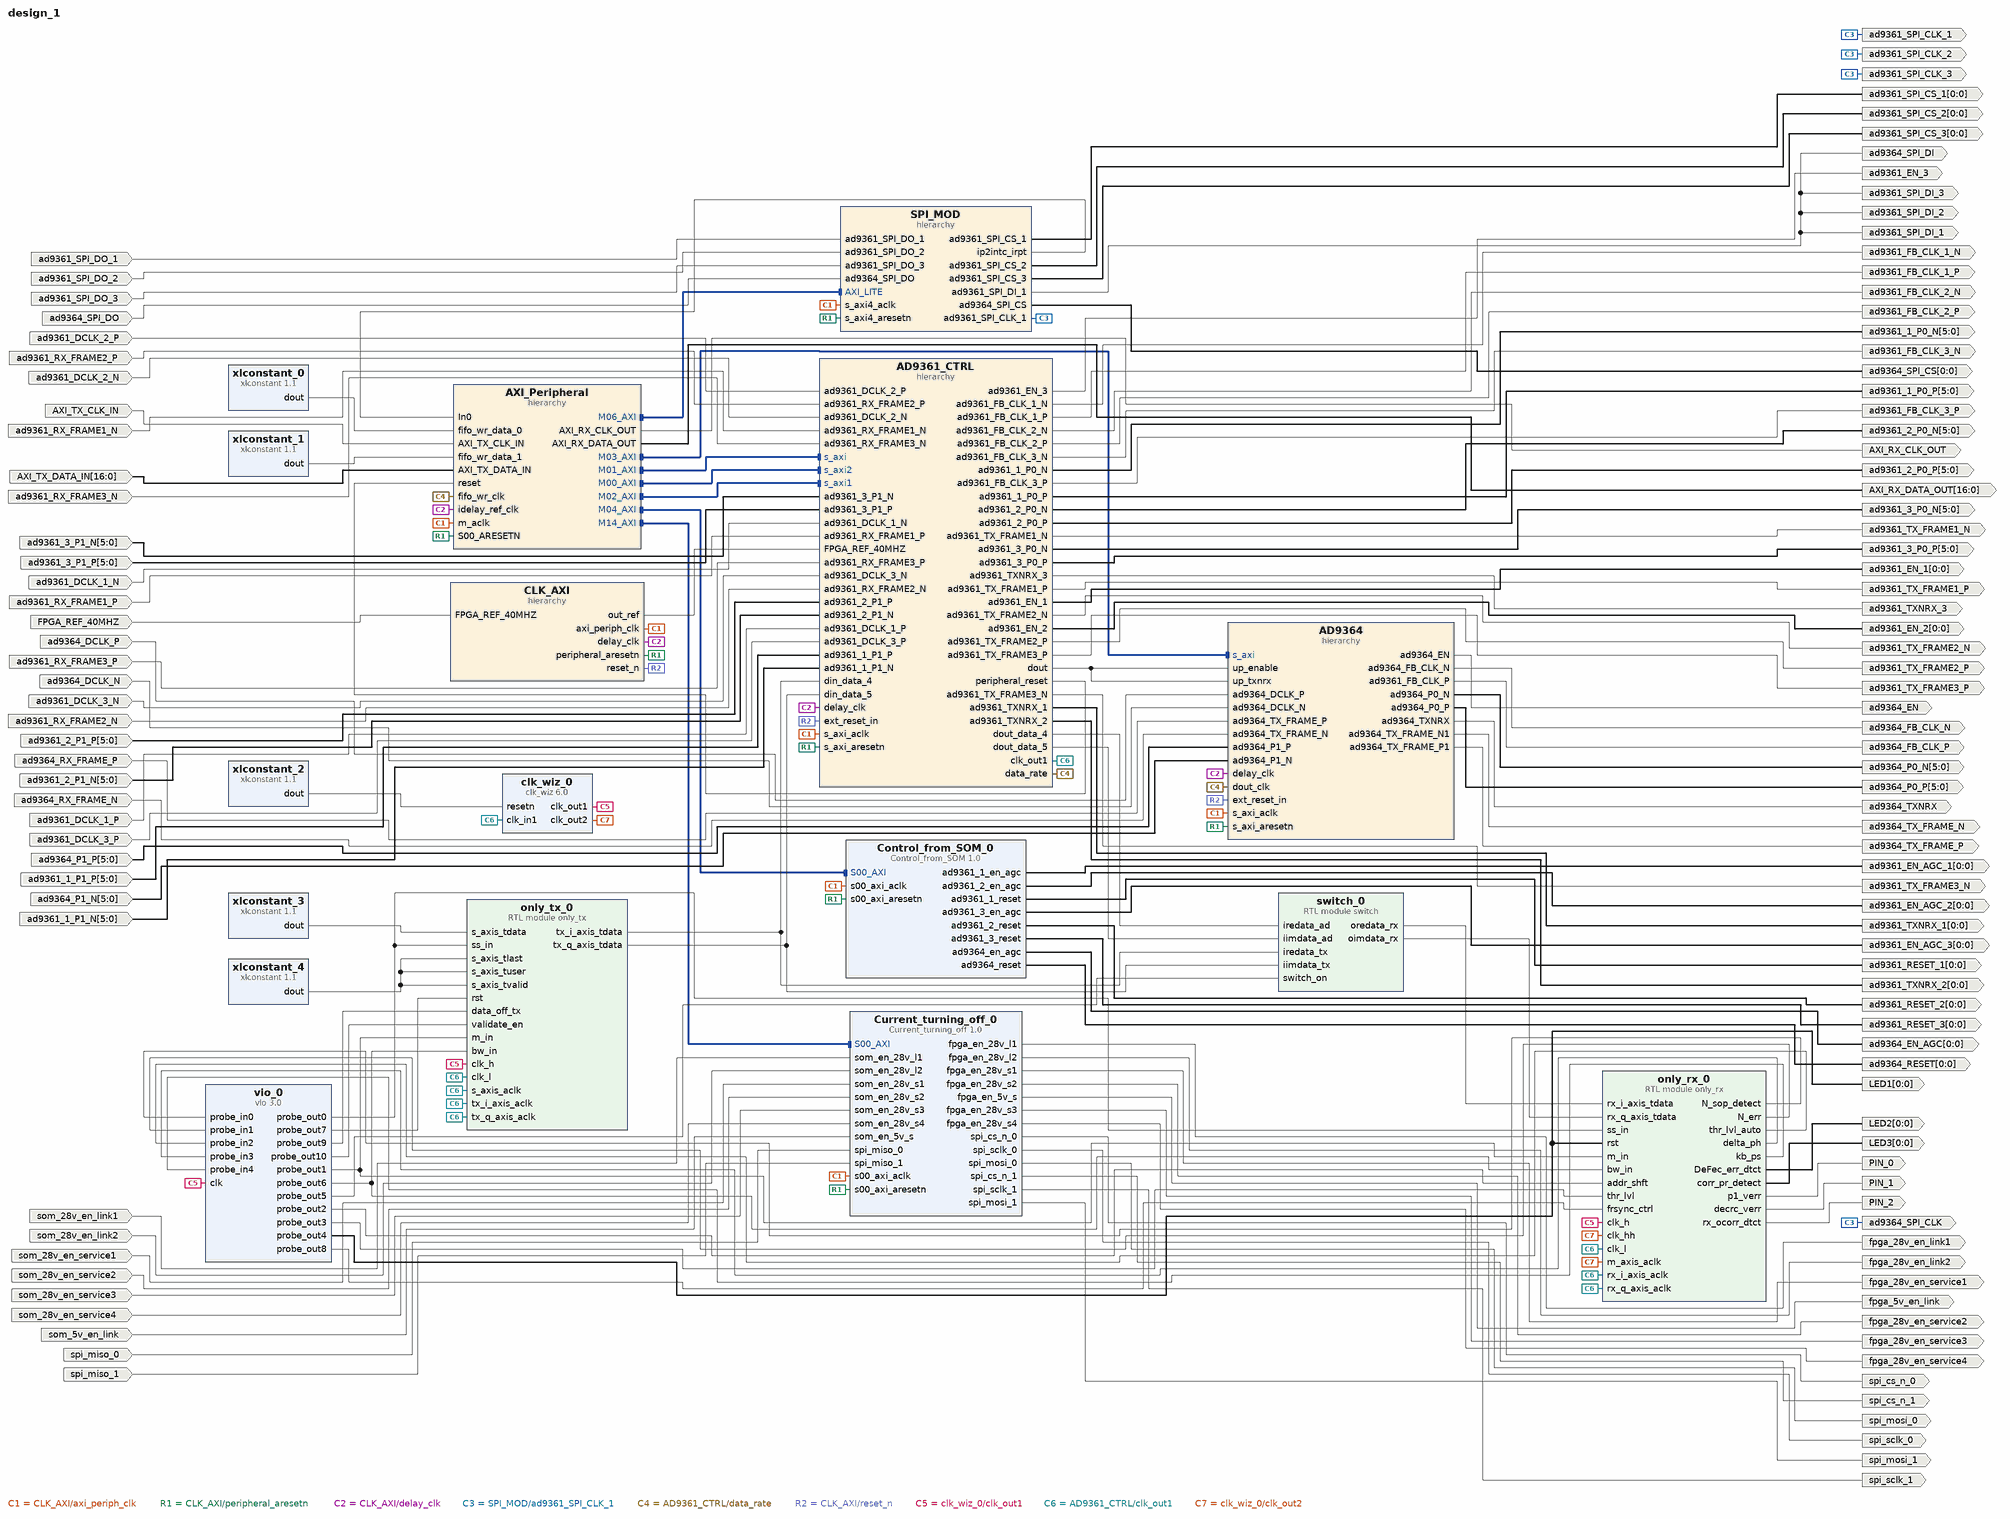
[diagram p0: block diagram of the top level]
# Vivado block design design_1, xc7k325tffg676-2, Vivado 2019.1
create_bd_design design_1

create_bd_port -dir O AXI_RX_CLK_OUT
create_bd_port -dir O -from 16 -to 0 AXI_RX_DATA_OUT
create_bd_port -dir I AXI_TX_CLK_IN
create_bd_port -dir I -from 16 -to 0 AXI_TX_DATA_IN
create_bd_port -dir I FPGA_REF_40MHZ
create_bd_port -dir O -from 0 -to 0 ad9361_EN_1
create_bd_port -dir O -from 0 -to 0 ad9361_EN_2
create_bd_port -dir O ad9361_EN_3
create_bd_port -dir O -from 0 -to 0 ad9361_TXNRX_1
create_bd_port -dir O -from 0 -to 0 ad9361_TXNRX_2
create_bd_port -dir O ad9361_TXNRX_3
create_bd_port -dir O ad9364_EN
create_bd_port -dir O ad9364_TXNRX
create_bd_port -dir O -from 0 -to 0 ad9361_RESET_1
create_bd_port -dir O -from 0 -to 0 ad9361_RESET_2
create_bd_port -dir O -from 0 -to 0 ad9361_RESET_3
create_bd_port -dir O -from 0 -to 0 ad9364_RESET
create_bd_port -dir O -from 0 -to 0 ad9361_SPI_CS_3
create_bd_port -dir O ad9361_SPI_CLK_3
create_bd_port -dir O ad9361_SPI_DI_3
create_bd_port -dir O ad9361_SPI_CLK_1
create_bd_port -dir O -from 0 -to 0 ad9361_SPI_CS_1
create_bd_port -dir O ad9361_SPI_DI_1
create_bd_port -dir O ad9361_SPI_CLK_2
create_bd_port -dir O -from 0 -to 0 ad9361_SPI_CS_2
create_bd_port -dir O ad9361_SPI_DI_2
create_bd_port -dir O ad9364_SPI_CLK
create_bd_port -dir O -from 0 -to 0 ad9364_SPI_CS
create_bd_port -dir O ad9364_SPI_DI
create_bd_port -dir I ad9361_DCLK_1_P
create_bd_port -dir I ad9361_DCLK_1_N
create_bd_port -dir I ad9361_DCLK_2_N
create_bd_port -dir I ad9361_DCLK_2_P
create_bd_port -dir I ad9361_DCLK_3_N
create_bd_port -dir I ad9364_DCLK_P
create_bd_port -dir I ad9364_DCLK_N
create_bd_port -dir I ad9361_RX_FRAME1_P
create_bd_port -dir I ad9361_RX_FRAME1_N
create_bd_port -dir I ad9361_RX_FRAME2_P
create_bd_port -dir I ad9361_RX_FRAME2_N
create_bd_port -dir I ad9361_RX_FRAME3_P
create_bd_port -dir I ad9364_RX_FRAME_P
create_bd_port -dir I ad9361_RX_FRAME3_N
create_bd_port -dir I ad9364_RX_FRAME_N
create_bd_port -dir I -from 5 -to 0 ad9361_1_P1_P
create_bd_port -dir I -from 5 -to 0 ad9361_1_P1_N
create_bd_port -dir I -from 5 -to 0 ad9361_2_P1_N
create_bd_port -dir I -from 5 -to 0 ad9361_2_P1_P
create_bd_port -dir I -from 5 -to 0 ad9361_3_P1_N
create_bd_port -dir I -from 5 -to 0 ad9361_3_P1_P
create_bd_port -dir I -from 5 -to 0 ad9364_P1_N
create_bd_port -dir I -from 5 -to 0 ad9364_P1_P
create_bd_port -dir I ad9361_DCLK_3_P
create_bd_port -dir I ad9364_SPI_DO
create_bd_port -dir I ad9361_SPI_DO_3
create_bd_port -dir I ad9361_SPI_DO_1
create_bd_port -dir I ad9361_SPI_DO_2
create_bd_port -dir O ad9361_FB_CLK_1_P
create_bd_port -dir O ad9361_FB_CLK_1_N
create_bd_port -dir O ad9361_TX_FRAME1_N
create_bd_port -dir O ad9361_TX_FRAME1_P
create_bd_port -dir O ad9361_FB_CLK_2_N
create_bd_port -dir O ad9361_FB_CLK_2_P
create_bd_port -dir O ad9361_FB_CLK_3_N
create_bd_port -dir O ad9361_FB_CLK_3_P
create_bd_port -dir O ad9364_FB_CLK_N
create_bd_port -dir O ad9364_FB_CLK_P
create_bd_port -dir O ad9361_TX_FRAME2_N
create_bd_port -dir O ad9361_TX_FRAME2_P
create_bd_port -dir O ad9361_TX_FRAME3_N
create_bd_port -dir O ad9364_TX_FRAME_N
create_bd_port -dir O ad9361_TX_FRAME3_P
create_bd_port -dir O ad9364_TX_FRAME_P
create_bd_port -dir O -from 5 -to 0 ad9361_1_P0_N
create_bd_port -dir O -from 5 -to 0 ad9361_1_P0_P
create_bd_port -dir O -from 5 -to 0 ad9361_2_P0_N
create_bd_port -dir O -from 5 -to 0 ad9361_2_P0_P
create_bd_port -dir O -from 5 -to 0 ad9361_3_P0_N
create_bd_port -dir O -from 5 -to 0 ad9361_3_P0_P
create_bd_port -dir O -from 5 -to 0 ad9364_P0_N
create_bd_port -dir O -from 5 -to 0 ad9364_P0_P
create_bd_port -dir O -from 0 -to 0 ad9361_EN_AGC_2
create_bd_port -dir O -from 0 -to 0 ad9361_EN_AGC_3
create_bd_port -dir O -from 0 -to 0 ad9361_EN_AGC_1
create_bd_port -dir O -from 0 -to 0 ad9364_EN_AGC
create_bd_port -dir O PIN_1
create_bd_port -dir O PIN_2
create_bd_port -dir O -from 0 -to 0 LED3
create_bd_port -dir O -from 0 -to 0 LED2
create_bd_port -dir O -from 0 -to 0 LED1
create_bd_port -dir O fpga_28v_en_link1
create_bd_port -dir O fpga_28v_en_link2
create_bd_port -dir O fpga_28v_en_service1
create_bd_port -dir O fpga_28v_en_service2
create_bd_port -dir O fpga_28v_en_service3
create_bd_port -dir O fpga_28v_en_service4
create_bd_port -dir O fpga_5v_en_link
create_bd_port -dir O spi_cs_n_0
create_bd_port -dir O spi_sclk_0
create_bd_port -dir O spi_mosi_0
create_bd_port -dir O spi_cs_n_1
create_bd_port -dir O spi_sclk_1
create_bd_port -dir O spi_mosi_1
create_bd_port -dir I som_28v_en_link1
create_bd_port -dir I som_28v_en_link2
create_bd_port -dir I som_28v_en_service1
create_bd_port -dir I som_28v_en_service2
create_bd_port -dir I som_28v_en_service3
create_bd_port -dir I som_28v_en_service4
create_bd_port -dir I som_5v_en_link
create_bd_port -dir I spi_miso_0
create_bd_port -dir I spi_miso_1
create_bd_port -dir O PIN_0

create_bd_cell -type hier AXI_Peripheral
create_bd_cell -type hier CLK_AXI
create_bd_cell -type hier AD9364
create_bd_cell -type hier AD9361_CTRL
create_bd_cell -type hier SPI_MOD
create_bd_cell -type ip -vlnv xilinx.com:user:Control_from_SOM:1.0 Control_from_SOM_0
create_bd_cell -type ip -vlnv xilinx.com:user:Current_turning_off:1.0 Current_turning_off_0
create_bd_cell -type ip -vlnv xilinx.com:ip:xlconstant:1.1 xlconstant_0
set_property -dict {CONFIG.CONST_WIDTH 16} [get_bd_cells xlconstant_0]
create_bd_cell -type ip -vlnv xilinx.com:ip:xlconstant:1.1 xlconstant_1
set_property -dict {CONFIG.CONST_WIDTH 16} [get_bd_cells xlconstant_1]
create_bd_cell -type ip -vlnv xilinx.com:ip:vio:3.0 vio_0
set_property -dict [list \
  CONFIG.C_EN_PROBE_IN_ACTIVITY 0 \
  CONFIG.C_NUM_PROBE_IN 5 \
  CONFIG.C_NUM_PROBE_OUT 11 \
  CONFIG.C_PROBE_OUT0_INIT_VAL 0x1 \
  CONFIG.C_PROBE_OUT0_WIDTH 4 \
  CONFIG.C_PROBE_OUT1_INIT_VAL 0x2 \
  CONFIG.C_PROBE_OUT1_WIDTH 3 \
  CONFIG.C_PROBE_OUT2_WIDTH 14 \
  CONFIG.C_PROBE_OUT3_WIDTH 24 \
  CONFIG.C_PROBE_OUT6_WIDTH 3 \
  CONFIG.C_PROBE_OUT8_WIDTH 2 \
] [get_bd_cells vio_0]
create_bd_cell -type ip -vlnv xilinx.com:ip:clk_wiz:6.0 clk_wiz_0
set_property -dict [list \
  CONFIG.CLKIN1_JITTER_PS 325.52 \
  CONFIG.CLKOUT1_DRIVES BUFG \
  CONFIG.CLKOUT1_JITTER 170.079 \
  CONFIG.CLKOUT1_PHASE_ERROR 194.835 \
  CONFIG.CLKOUT1_REQUESTED_OUT_FREQ 184.320 \
  CONFIG.CLKOUT2_DRIVES BUFG \
  CONFIG.CLKOUT2_JITTER 160.853 \
  CONFIG.CLKOUT2_PHASE_ERROR 194.835 \
  CONFIG.CLKOUT2_REQUESTED_OUT_FREQ 280 \
  CONFIG.CLKOUT2_USED true \
  CONFIG.CLKOUT3_DRIVES BUFG \
  CONFIG.CLKOUT4_DRIVES BUFG \
  CONFIG.CLKOUT5_DRIVES BUFG \
  CONFIG.CLKOUT6_DRIVES BUFG \
  CONFIG.CLKOUT7_DRIVES BUFG \
  CONFIG.MMCM_BANDWIDTH OPTIMIZED \
  CONFIG.MMCM_CLKFBOUT_MULT_F 36 \
  CONFIG.MMCM_CLKIN1_PERIOD 32.552 \
  CONFIG.MMCM_CLKIN2_PERIOD 10.0 \
  CONFIG.MMCM_CLKOUT0_DIVIDE_F 6 \
  CONFIG.MMCM_CLKOUT1_DIVIDE 4 \
  CONFIG.MMCM_COMPENSATION ZHOLD \
  CONFIG.MMCM_DIVCLK_DIVIDE 1 \
  CONFIG.NUM_OUT_CLKS 2 \
  CONFIG.PRIMITIVE PLL \
  CONFIG.PRIM_IN_FREQ 30.72 \
  CONFIG.PRIM_SOURCE Global_buffer \
  CONFIG.RESET_PORT resetn \
  CONFIG.RESET_TYPE ACTIVE_LOW \
] [get_bd_cells clk_wiz_0]
create_bd_cell -type ip -vlnv xilinx.com:ip:xlconstant:1.1 xlconstant_2
create_bd_cell -type ip -vlnv xilinx.com:ip:xlconstant:1.1 xlconstant_3
set_property -dict {CONFIG.CONST_VAL 0 CONFIG.CONST_WIDTH 8} [get_bd_cells xlconstant_3]
create_bd_cell -type ip -vlnv xilinx.com:ip:xlconstant:1.1 xlconstant_4
set_property -dict {CONFIG.CONST_VAL 0 CONFIG.CONST_WIDTH 1} [get_bd_cells xlconstant_4]
create_bd_cell -type module -reference only_rx only_rx_0
create_bd_cell -type module -reference only_tx only_tx_0
create_bd_cell -type module -reference switch switch_0

# ---- hierarchy /AXI_Peripheral ----
current_bd_instance /AXI_Peripheral
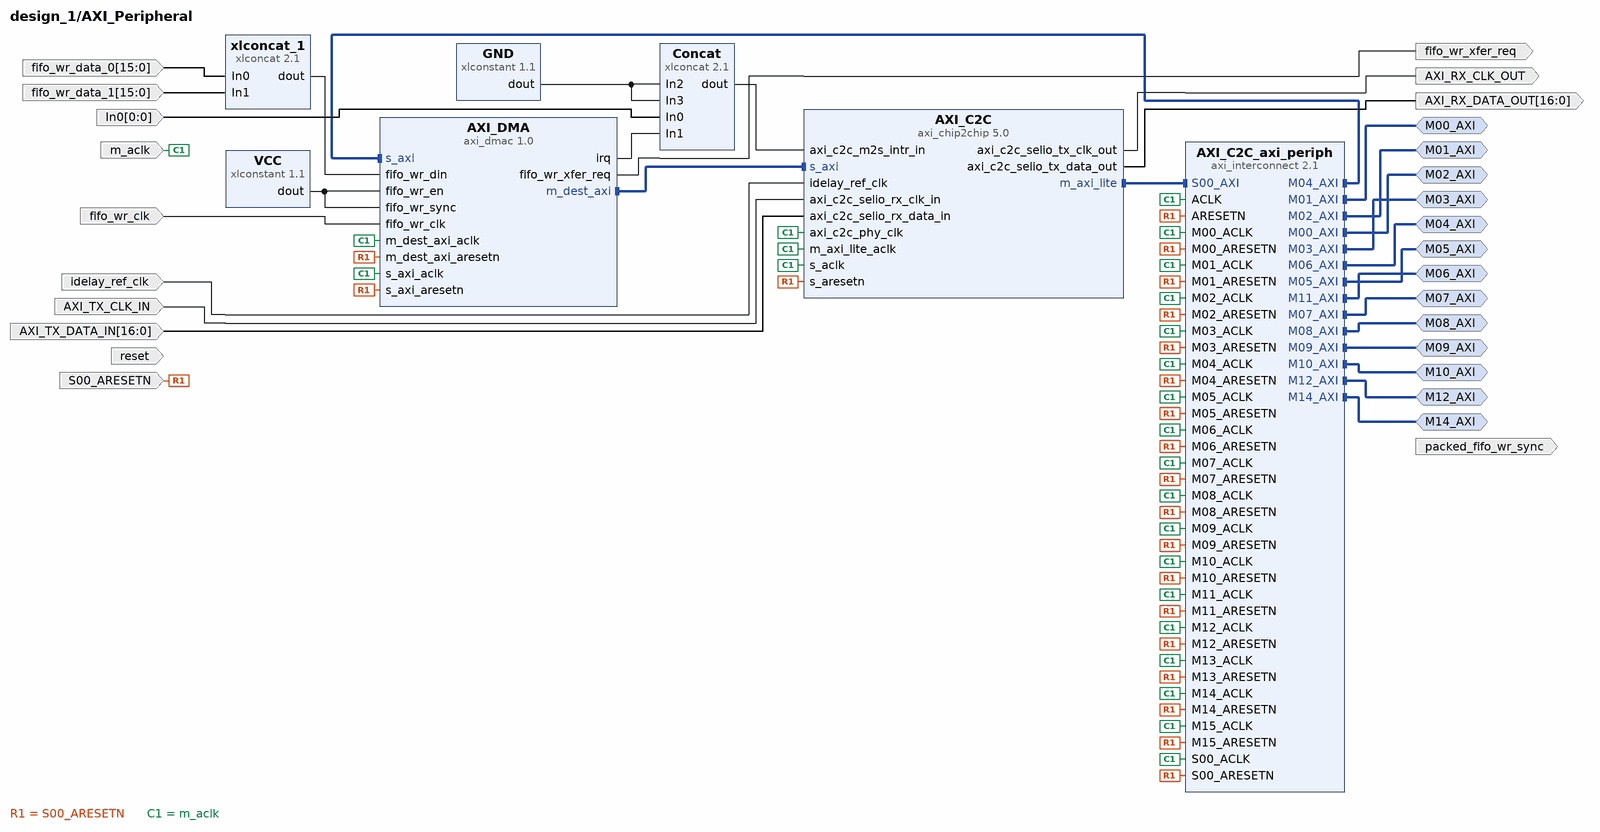
[diagram p1: block diagram inside /AXI_Peripheral]
create_bd_intf_pin -mode Master -vlnv xilinx.com:interface:aximm_rtl:1.0 M00_AXI
create_bd_intf_pin -mode Master -vlnv xilinx.com:interface:aximm_rtl:1.0 M01_AXI
create_bd_intf_pin -mode Master -vlnv xilinx.com:interface:aximm_rtl:1.0 M02_AXI
create_bd_intf_pin -mode Master -vlnv xilinx.com:interface:aximm_rtl:1.0 M03_AXI
create_bd_intf_pin -mode Master -vlnv xilinx.com:interface:aximm_rtl:1.0 M04_AXI
create_bd_intf_pin -mode Master -vlnv xilinx.com:interface:aximm_rtl:1.0 M06_AXI
create_bd_intf_pin -mode Master -vlnv xilinx.com:interface:aximm_rtl:1.0 M14_AXI
create_bd_intf_pin -mode Master -vlnv xilinx.com:interface:aximm_rtl:1.0 M05_AXI
create_bd_intf_pin -mode Master -vlnv xilinx.com:interface:aximm_rtl:1.0 M07_AXI
create_bd_intf_pin -mode Master -vlnv xilinx.com:interface:aximm_rtl:1.0 M08_AXI
create_bd_intf_pin -mode Master -vlnv xilinx.com:interface:aximm_rtl:1.0 M09_AXI
create_bd_intf_pin -mode Master -vlnv xilinx.com:interface:aximm_rtl:1.0 M10_AXI
create_bd_intf_pin -mode Master -vlnv xilinx.com:interface:aximm_rtl:1.0 M12_AXI
create_bd_pin -dir O -type clk AXI_RX_CLK_OUT
create_bd_pin -dir O -from 16 -to 0 AXI_RX_DATA_OUT
create_bd_pin -dir I -type clk AXI_TX_CLK_IN
create_bd_pin -dir I -from 16 -to 0 AXI_TX_DATA_IN
create_bd_pin -dir I -type rst S00_ARESETN
create_bd_pin -dir I -type clk idelay_ref_clk
create_bd_pin -dir I -type clk m_aclk
create_bd_pin -dir I -from 0 -to 0 In0
create_bd_pin -dir I -type clk fifo_wr_clk
create_bd_pin -dir I -from 15 -to 0 fifo_wr_data_0
create_bd_pin -dir I -from 15 -to 0 fifo_wr_data_1
create_bd_pin -dir I -type rst reset
create_bd_pin -dir O packed_fifo_wr_sync
create_bd_pin -dir O fifo_wr_xfer_req

create_bd_cell -type ip -vlnv xilinx.com:ip:xlconcat:2.1 Concat
set_property -dict {CONFIG.NUM_PORTS 4} [get_bd_cells Concat]
create_bd_cell -type ip -vlnv xilinx.com:ip:xlconstant:1.1 GND
set_property -dict {CONFIG.CONST_VAL 0} [get_bd_cells GND]
create_bd_cell -type ip -vlnv xilinx.com:ip:xlconstant:1.1 VCC
create_bd_cell -type ip -vlnv xilinx.com:ip:axi_chip2chip:5.0 AXI_C2C
set_property -dict [list \
  CONFIG.C_COMMON_CLK 0 \
  CONFIG.C_INCLUDE_AXILITE 2 \
  CONFIG.C_INTERFACE_MODE 1 \
  CONFIG.C_MASTER_FPGA 1 \
] [get_bd_cells AXI_C2C]
create_bd_cell -type ip -vlnv xilinx.com:ip:axi_interconnect:2.1 AXI_C2C_axi_periph
set_property -dict {CONFIG.NUM_MI 16} [get_bd_cells AXI_C2C_axi_periph]
create_bd_cell -type ip -vlnv analog.com:user:axi_dmac:1.0 AXI_DMA
set_property -dict [list \
  CONFIG.ALLOW_ASYM_MEM 1 \
  CONFIG.CYCLIC false \
  CONFIG.DMA_AXI_PROTOCOL_DEST 0 \
  CONFIG.DMA_DATA_WIDTH_DEST 32 \
  CONFIG.DMA_DATA_WIDTH_SRC 32 \
  CONFIG.SYNC_TRANSFER_START true \
] [get_bd_cells AXI_DMA]
create_bd_cell -type ip -vlnv xilinx.com:ip:xlconcat:2.1 xlconcat_1
set_property -dict {CONFIG.IN0_WIDTH 16 CONFIG.IN1_WIDTH 16} [get_bd_cells xlconcat_1]

# ---- hierarchy /CLK_AXI ----
current_bd_instance /CLK_AXI
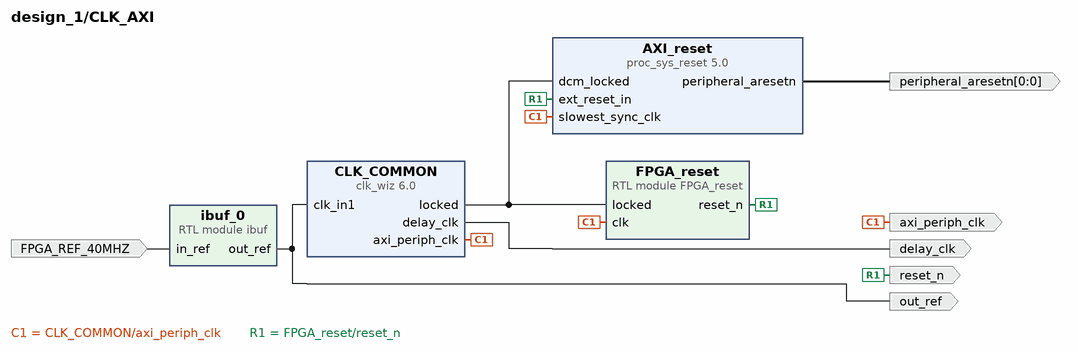
[diagram p2: block diagram inside /CLK_AXI]
create_bd_pin -dir O -type clk axi_periph_clk
create_bd_pin -dir O -type clk delay_clk
create_bd_pin -dir O -from 0 -to 0 -type rst peripheral_aresetn
create_bd_pin -dir O -type rst reset_n
create_bd_pin -dir O out_ref
create_bd_pin -dir I FPGA_REF_40MHZ

create_bd_cell -type ip -vlnv xilinx.com:ip:clk_wiz:6.0 CLK_COMMON
set_property -dict [list \
  CONFIG.CLKIN1_JITTER_PS 250.0 \
  CONFIG.CLKOUT1_JITTER 158.299 \
  CONFIG.CLKOUT1_PHASE_ERROR 191.950 \
  CONFIG.CLKOUT1_REQUESTED_OUT_FREQ 200.000 \
  CONFIG.CLKOUT2_JITTER 180.876 \
  CONFIG.CLKOUT2_PHASE_ERROR 191.950 \
  CONFIG.CLKOUT2_REQUESTED_OUT_FREQ 100 \
  CONFIG.CLKOUT2_USED true \
  CONFIG.CLKOUT3_JITTER 232.099 \
  CONFIG.CLKOUT3_PHASE_ERROR 191.950 \
  CONFIG.CLKOUT3_REQUESTED_OUT_FREQ 100.000 \
  CONFIG.CLKOUT3_USED false \
  CONFIG.CLK_OUT1_PORT delay_clk \
  CONFIG.CLK_OUT2_PORT axi_periph_clk \
  CONFIG.CLK_OUT3_PORT clk_out3 \
  CONFIG.MMCM_CLKFBOUT_MULT_F 25.000 \
  CONFIG.MMCM_CLKIN1_PERIOD 25.000 \
  CONFIG.MMCM_CLKIN2_PERIOD 10.0 \
  CONFIG.MMCM_CLKOUT0_DIVIDE_F 5.000 \
  CONFIG.MMCM_CLKOUT1_DIVIDE 10 \
  CONFIG.MMCM_CLKOUT2_DIVIDE 1 \
  CONFIG.NUM_OUT_CLKS 2 \
  CONFIG.PRIM_IN_FREQ 40.000 \
  CONFIG.PRIM_SOURCE No_buffer \
  CONFIG.USE_RESET false \
] [get_bd_cells CLK_COMMON]
create_bd_cell -type ip -vlnv xilinx.com:ip:proc_sys_reset:5.0 AXI_reset
set_property -dict {CONFIG.C_AUX_RST_WIDTH 16 CONFIG.C_EXT_RST_WIDTH 16} [get_bd_cells AXI_reset]
create_bd_cell -type module -reference ibuf ibuf_0
create_bd_cell -type module -reference FPGA_reset FPGA_reset

# ---- hierarchy /AD9364 ----
current_bd_instance /AD9364
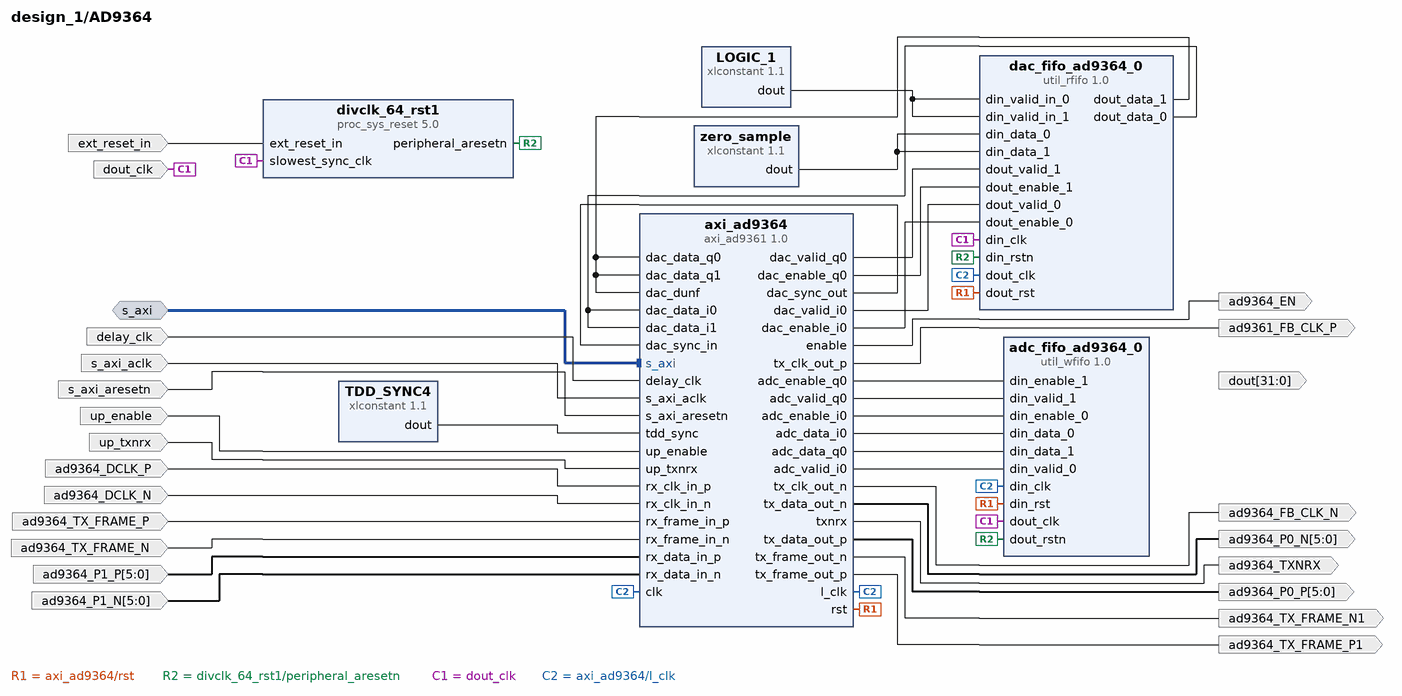
[diagram p3: block diagram inside /AD9364]
create_bd_intf_pin -mode Slave -vlnv xilinx.com:interface:aximm_rtl:1.0 s_axi
create_bd_pin -dir I -type clk delay_clk
create_bd_pin -dir I -type clk s_axi_aclk
create_bd_pin -dir I -type rst s_axi_aresetn
create_bd_pin -dir O ad9364_EN
create_bd_pin -dir O ad9364_TXNRX
create_bd_pin -dir I up_enable
create_bd_pin -dir I up_txnrx
create_bd_pin -dir I ad9364_DCLK_P
create_bd_pin -dir I ad9364_DCLK_N
create_bd_pin -dir I ad9364_TX_FRAME_P
create_bd_pin -dir I ad9364_TX_FRAME_N
create_bd_pin -dir I -from 5 -to 0 ad9364_P1_P
create_bd_pin -dir I -from 5 -to 0 ad9364_P1_N
create_bd_pin -dir O ad9361_FB_CLK_P
create_bd_pin -dir O ad9364_FB_CLK_N
create_bd_pin -dir O ad9364_TX_FRAME_P1
create_bd_pin -dir O ad9364_TX_FRAME_N1
create_bd_pin -dir O -from 5 -to 0 ad9364_P0_P
create_bd_pin -dir O -from 5 -to 0 ad9364_P0_N
create_bd_pin -dir I -type rst ext_reset_in
create_bd_pin -dir O -from 31 -to 0 dout
create_bd_pin -dir I -type clk dout_clk

create_bd_cell -type ip -vlnv xilinx.com:ip:xlconstant:1.1 LOGIC_1
set_property -dict {CONFIG.CONST_VAL 1 CONFIG.CONST_WIDTH 1} [get_bd_cells LOGIC_1]
create_bd_cell -type ip -vlnv xilinx.com:ip:xlconstant:1.1 TDD_SYNC4
set_property -dict {CONFIG.CONST_VAL 0} [get_bd_cells TDD_SYNC4]
create_bd_cell -type ip -vlnv analog.com:user:util_wfifo:1.0 adc_fifo_ad9364_0
set_property -dict [list \
  CONFIG.DIN_ADDRESS_WIDTH 4 \
  CONFIG.DIN_DATA_WIDTH 16 \
  CONFIG.DOUT_DATA_WIDTH 16 \
  CONFIG.NUM_OF_CHANNELS 2 \
] [get_bd_cells adc_fifo_ad9364_0]
create_bd_cell -type ip -vlnv analog.com:user:util_rfifo:1.0 dac_fifo_ad9364_0
set_property -dict [list \
  CONFIG.DIN_ADDRESS_WIDTH 4 \
  CONFIG.DIN_DATA_WIDTH 16 \
  CONFIG.DOUT_DATA_WIDTH 16 \
  CONFIG.NUM_OF_CHANNELS 2 \
] [get_bd_cells dac_fifo_ad9364_0]
create_bd_cell -type ip -vlnv xilinx.com:ip:xlconstant:1.1 zero_sample
set_property -dict {CONFIG.CONST_VAL 0 CONFIG.CONST_WIDTH 16} [get_bd_cells zero_sample]
create_bd_cell -type ip -vlnv xilinx.com:ip:proc_sys_reset:5.0 divclk_64_rst1
set_property -dict {CONFIG.C_AUX_RESET_HIGH 0} [get_bd_cells divclk_64_rst1]
create_bd_cell -type ip -vlnv analog.com:user:axi_ad9361:1.0 axi_ad9364
set_property -dict [list \
  CONFIG.ADC_DATAFORMAT_DISABLE 0 \
  CONFIG.ADC_DATAPATH_DISABLE 0 \
  CONFIG.ADC_DCFILTER_DISABLE 1 \
  CONFIG.ADC_INIT_DELAY 0 \
  CONFIG.ADC_IQCORRECTION_DISABLE 1 \
  CONFIG.ADC_USERPORTS_DISABLE 0 \
  CONFIG.CMOS_OR_LVDS_N 0 \
  CONFIG.DAC_DATAPATH_DISABLE 0 \
  CONFIG.DAC_DDS_DISABLE 1 \
  CONFIG.DAC_DDS_TYPE 1 \
  CONFIG.DAC_INIT_DELAY 0 \
  CONFIG.DAC_IQCORRECTION_DISABLE 1 \
  CONFIG.DAC_USERPORTS_DISABLE 0 \
  CONFIG.DEV_PACKAGE 3 \
  CONFIG.FPGA_FAMILY 3 \
  CONFIG.FPGA_TECHNOLOGY 1 \
  CONFIG.ID 0 \
  CONFIG.IO_DELAY_GROUP dev_4_if_delay_group \
  CONFIG.MODE_1R1T 1 \
  CONFIG.SPEED_GRADE 10 \
  CONFIG.TDD_DISABLE 1 \
] [get_bd_cells axi_ad9364]

# ---- hierarchy /AD9361_CTRL ----
current_bd_instance /AD9361_CTRL
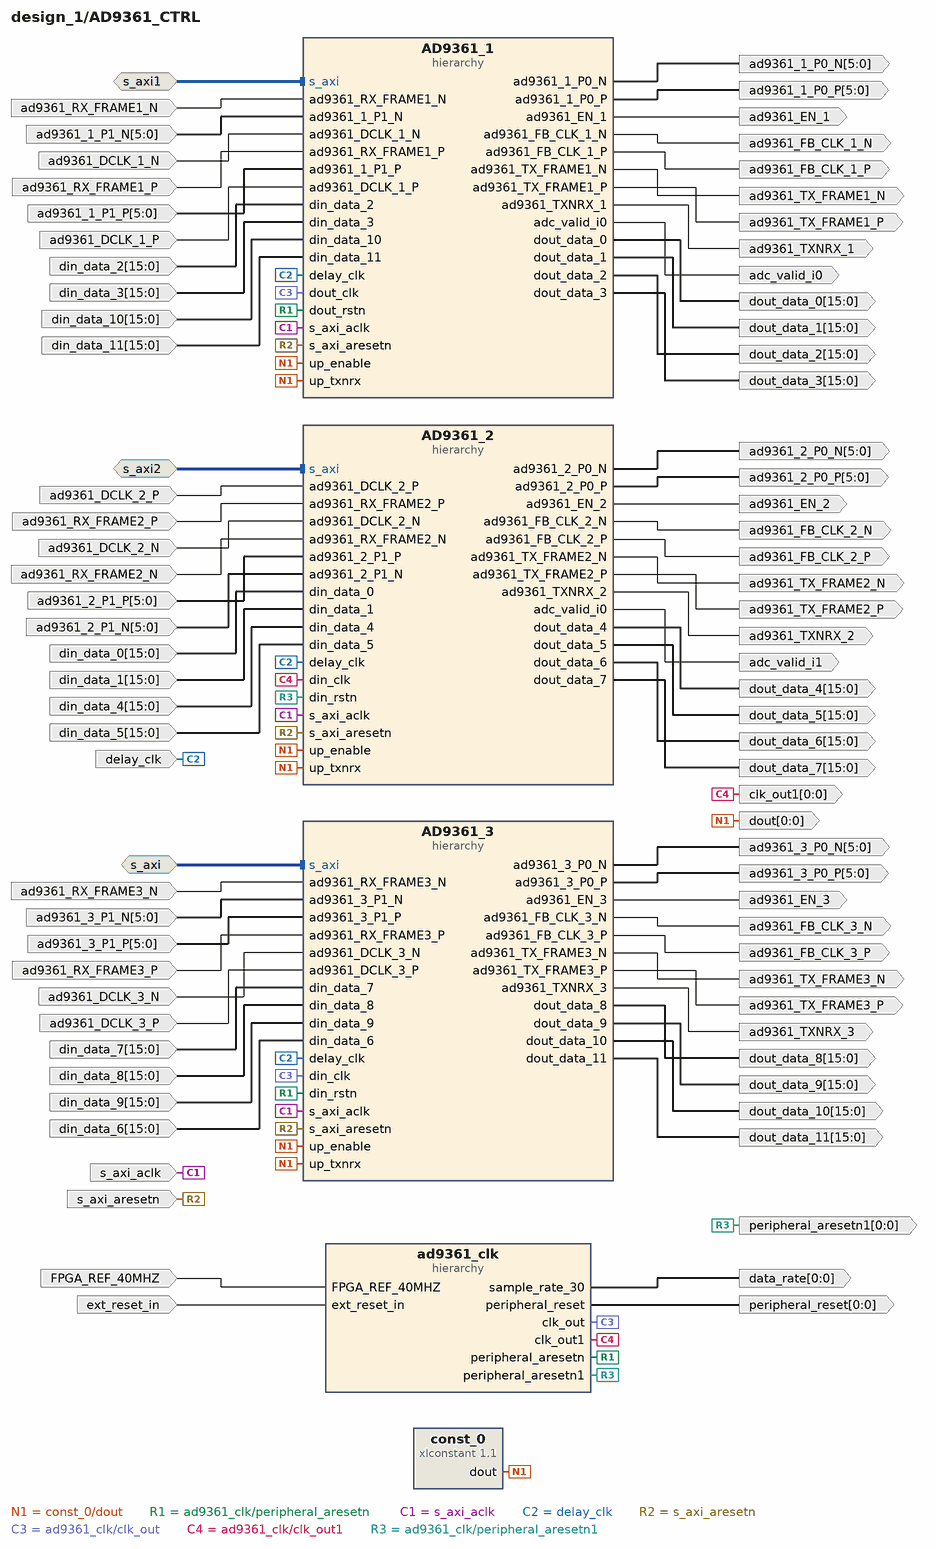
[diagram p4: block diagram inside /AD9361_CTRL]
create_bd_intf_pin -mode Slave -vlnv xilinx.com:interface:aximm_rtl:1.0 s_axi
create_bd_intf_pin -mode Slave -vlnv xilinx.com:interface:aximm_rtl:1.0 s_axi1
create_bd_intf_pin -mode Slave -vlnv xilinx.com:interface:aximm_rtl:1.0 s_axi2
create_bd_pin -dir I ad9361_DCLK_2_P
create_bd_pin -dir I ad9361_RX_FRAME2_P
create_bd_pin -dir I ad9361_DCLK_2_N
create_bd_pin -dir I ad9361_RX_FRAME1_N
create_bd_pin -dir I ad9361_RX_FRAME3_N
create_bd_pin -dir I -from 5 -to 0 ad9361_3_P1_N
create_bd_pin -dir I -from 5 -to 0 ad9361_3_P1_P
create_bd_pin -dir I -from 5 -to 0 ad9361_1_P1_N
create_bd_pin -dir I ad9361_DCLK_1_N
create_bd_pin -dir I ad9361_RX_FRAME1_P
create_bd_pin -dir I ad9361_RX_FRAME3_P
create_bd_pin -dir I ad9361_DCLK_3_N
create_bd_pin -dir I ad9361_RX_FRAME2_N
create_bd_pin -dir I -from 5 -to 0 ad9361_2_P1_P
create_bd_pin -dir I -from 5 -to 0 ad9361_2_P1_N
create_bd_pin -dir I -from 5 -to 0 ad9361_1_P1_P
create_bd_pin -dir I -type clk s_axi_aclk
create_bd_pin -dir I -type clk delay_clk
create_bd_pin -dir I -type rst s_axi_aresetn
create_bd_pin -dir I ad9361_DCLK_1_P
create_bd_pin -dir O ad9361_TXNRX_3
create_bd_pin -dir O ad9361_EN_3
create_bd_pin -dir I ad9361_DCLK_3_P
create_bd_pin -dir O ad9361_FB_CLK_1_P
create_bd_pin -dir O ad9361_FB_CLK_1_N
create_bd_pin -dir O ad9361_TX_FRAME1_P
create_bd_pin -dir O ad9361_TX_FRAME1_N
create_bd_pin -dir O ad9361_FB_CLK_2_P
create_bd_pin -dir O ad9361_FB_CLK_2_N
create_bd_pin -dir O ad9361_TX_FRAME2_P
create_bd_pin -dir O ad9361_TX_FRAME2_N
create_bd_pin -dir O ad9361_FB_CLK_3_P
create_bd_pin -dir O ad9361_FB_CLK_3_N
create_bd_pin -dir O ad9361_TX_FRAME3_P
create_bd_pin -dir O ad9361_TX_FRAME3_N
create_bd_pin -dir O -from 5 -to 0 ad9361_1_P0_P
create_bd_pin -dir O -from 5 -to 0 ad9361_1_P0_N
create_bd_pin -dir O -from 5 -to 0 ad9361_2_P0_P
create_bd_pin -dir O -from 5 -to 0 ad9361_2_P0_N
create_bd_pin -dir O -from 5 -to 0 ad9361_3_P0_P
create_bd_pin -dir O -from 5 -to 0 ad9361_3_P0_N
create_bd_pin -dir O ad9361_EN_1
create_bd_pin -dir O ad9361_EN_2
create_bd_pin -dir O ad9361_TXNRX_1
create_bd_pin -dir O ad9361_TXNRX_2
create_bd_pin -dir I -from 15 -to 0 din_data_0
create_bd_pin -dir I -from 15 -to 0 din_data_1
create_bd_pin -dir O -from 15 -to 0 dout_data_0
create_bd_pin -dir O -from 15 -to 0 dout_data_1
create_bd_pin -dir I -type clk FPGA_REF_40MHZ
create_bd_pin -dir O -from 0 -to 0 -type clk data_rate
create_bd_pin -dir O -from 15 -to 0 dout_data_2
create_bd_pin -dir O -from 15 -to 0 dout_data_3
create_bd_pin -dir O -from 15 -to 0 dout_data_4
create_bd_pin -dir O -from 15 -to 0 dout_data_5
create_bd_pin -dir O -from 15 -to 0 dout_data_6
create_bd_pin -dir O -from 15 -to 0 dout_data_7
create_bd_pin -dir O -from 15 -to 0 dout_data_8
create_bd_pin -dir O -from 15 -to 0 dout_data_9
create_bd_pin -dir O -from 15 -to 0 dout_data_10
create_bd_pin -dir O -from 15 -to 0 dout_data_11
create_bd_pin -dir I -from 15 -to 0 din_data_2
create_bd_pin -dir I -from 15 -to 0 din_data_3
create_bd_pin -dir I -from 15 -to 0 din_data_4
create_bd_pin -dir I -from 15 -to 0 din_data_5
create_bd_pin -dir I -from 15 -to 0 din_data_6
create_bd_pin -dir I -from 15 -to 0 din_data_7
create_bd_pin -dir I -from 15 -to 0 din_data_8
create_bd_pin -dir I -from 15 -to 0 din_data_9
create_bd_pin -dir I -from 15 -to 0 din_data_10
create_bd_pin -dir I -from 15 -to 0 din_data_11
create_bd_pin -dir I -type rst ext_reset_in
create_bd_pin -dir O -from 0 -to 0 -type rst peripheral_reset
create_bd_pin -dir O -from 0 -to 0 -type clk clk_out1
create_bd_pin -dir O -from 0 -to 0 -type rst peripheral_aresetn1
create_bd_pin -dir O adc_valid_i0
create_bd_pin -dir O adc_valid_i1
create_bd_pin -dir O -from 0 -to 0 dout

create_bd_cell -type hier AD9361_1
create_bd_cell -type hier AD9361_2
create_bd_cell -type hier AD9361_3
create_bd_cell -type hier ad9361_clk
create_bd_cell -type ip -vlnv xilinx.com:ip:xlconstant:1.1 const_0
set_property -dict {CONFIG.CONST_VAL 0} [get_bd_cells const_0]

# ---- hierarchy /AD9361_CTRL/AD9361_1 ----
current_bd_instance /AD9361_CTRL/AD9361_1
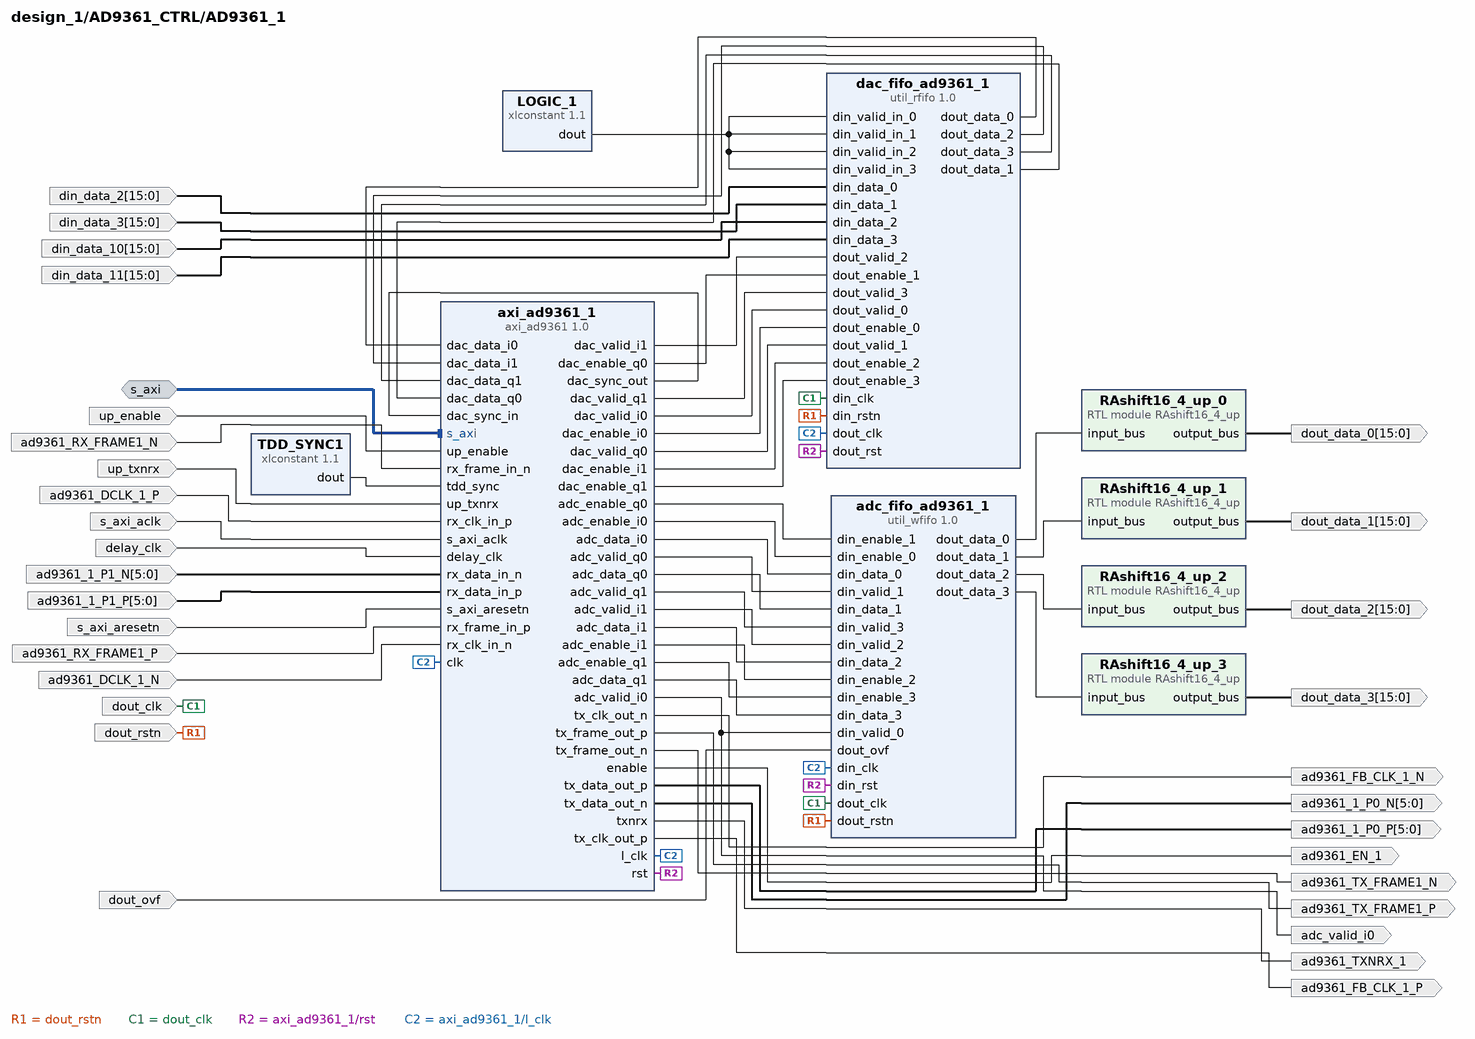
[diagram p5: block diagram inside /AD9361_CTRL/AD9361_1]
create_bd_intf_pin -mode Slave -vlnv xilinx.com:interface:aximm_rtl:1.0 s_axi
create_bd_pin -dir I -type rst dout_rstn
create_bd_pin -dir I -type clk dout_clk
create_bd_pin -dir I -type clk delay_clk
create_bd_pin -dir I -type clk s_axi_aclk
create_bd_pin -dir I -type rst s_axi_aresetn
create_bd_pin -dir I up_enable
create_bd_pin -dir I up_txnrx
create_bd_pin -dir I ad9361_DCLK_1_P
create_bd_pin -dir I ad9361_DCLK_1_N
create_bd_pin -dir I ad9361_RX_FRAME1_P
create_bd_pin -dir I ad9361_RX_FRAME1_N
create_bd_pin -dir I -from 5 -to 0 ad9361_1_P1_P
create_bd_pin -dir I -from 5 -to 0 ad9361_1_P1_N
create_bd_pin -dir O ad9361_FB_CLK_1_P
create_bd_pin -dir O ad9361_FB_CLK_1_N
create_bd_pin -dir O ad9361_TX_FRAME1_P
create_bd_pin -dir O ad9361_TX_FRAME1_N
create_bd_pin -dir O -from 5 -to 0 ad9361_1_P0_P
create_bd_pin -dir O -from 5 -to 0 ad9361_1_P0_N
create_bd_pin -dir O ad9361_EN_1
create_bd_pin -dir O ad9361_TXNRX_1
create_bd_pin -dir O -from 15 -to 0 dout_data_0
create_bd_pin -dir O -from 15 -to 0 dout_data_1
create_bd_pin -dir O -from 15 -to 0 dout_data_2
create_bd_pin -dir O -from 15 -to 0 dout_data_3
create_bd_pin -dir I -from 15 -to 0 din_data_2
create_bd_pin -dir I -from 15 -to 0 din_data_3
create_bd_pin -dir I -from 15 -to 0 din_data_10
create_bd_pin -dir I -from 15 -to 0 din_data_11
create_bd_pin -dir I dout_ovf
create_bd_pin -dir O adc_valid_i0

create_bd_cell -type ip -vlnv xilinx.com:ip:xlconstant:1.1 LOGIC_1
set_property -dict {CONFIG.CONST_VAL 1 CONFIG.CONST_WIDTH 1} [get_bd_cells LOGIC_1]
create_bd_cell -type ip -vlnv xilinx.com:ip:xlconstant:1.1 TDD_SYNC1
set_property -dict {CONFIG.CONST_VAL 0} [get_bd_cells TDD_SYNC1]
create_bd_cell -type ip -vlnv analog.com:user:util_wfifo:1.0 adc_fifo_ad9361_1
set_property -dict [list \
  CONFIG.DIN_ADDRESS_WIDTH 4 \
  CONFIG.DIN_DATA_WIDTH 16 \
  CONFIG.DOUT_DATA_WIDTH 16 \
] [get_bd_cells adc_fifo_ad9361_1]
create_bd_cell -type ip -vlnv analog.com:user:util_rfifo:1.0 dac_fifo_ad9361_1
set_property -dict [list \
  CONFIG.DIN_ADDRESS_WIDTH 4 \
  CONFIG.DIN_DATA_WIDTH 16 \
  CONFIG.DOUT_DATA_WIDTH 16 \
] [get_bd_cells dac_fifo_ad9361_1]
create_bd_cell -type module -reference RAshift16_4_up RAshift16_4_up_1
create_bd_cell -type module -reference RAshift16_4_up RAshift16_4_up_2
create_bd_cell -type module -reference RAshift16_4_up RAshift16_4_up_3
create_bd_cell -type module -reference RAshift16_4_up RAshift16_4_up_0
create_bd_cell -type ip -vlnv analog.com:user:axi_ad9361:1.0 axi_ad9361_1
set_property -dict [list \
  CONFIG.ADC_DATAFORMAT_DISABLE 0 \
  CONFIG.ADC_DATAPATH_DISABLE 0 \
  CONFIG.ADC_DCFILTER_DISABLE 1 \
  CONFIG.ADC_INIT_DELAY 0 \
  CONFIG.ADC_IQCORRECTION_DISABLE 1 \
  CONFIG.ADC_USERPORTS_DISABLE 0 \
  CONFIG.CMOS_OR_LVDS_N 0 \
  CONFIG.DAC_DATAPATH_DISABLE 0 \
  CONFIG.DAC_DDS_CORDIC_DW 14 \
  CONFIG.DAC_DDS_DISABLE 1 \
  CONFIG.DAC_DDS_TYPE 1 \
  CONFIG.DAC_INIT_DELAY 0 \
  CONFIG.DAC_IQCORRECTION_DISABLE 1 \
  CONFIG.DAC_USERPORTS_DISABLE 0 \
  CONFIG.DEV_PACKAGE 3 \
  CONFIG.FPGA_FAMILY 3 \
  CONFIG.FPGA_TECHNOLOGY 1 \
  CONFIG.ID 0 \
  CONFIG.IO_DELAY_GROUP dev_0_if_delay_group \
  CONFIG.SPEED_GRADE 10 \
  CONFIG.TDD_DISABLE 1 \
] [get_bd_cells axi_ad9361_1]

# ---- hierarchy /AD9361_CTRL/AD9361_2 ----
current_bd_instance /AD9361_CTRL/AD9361_2
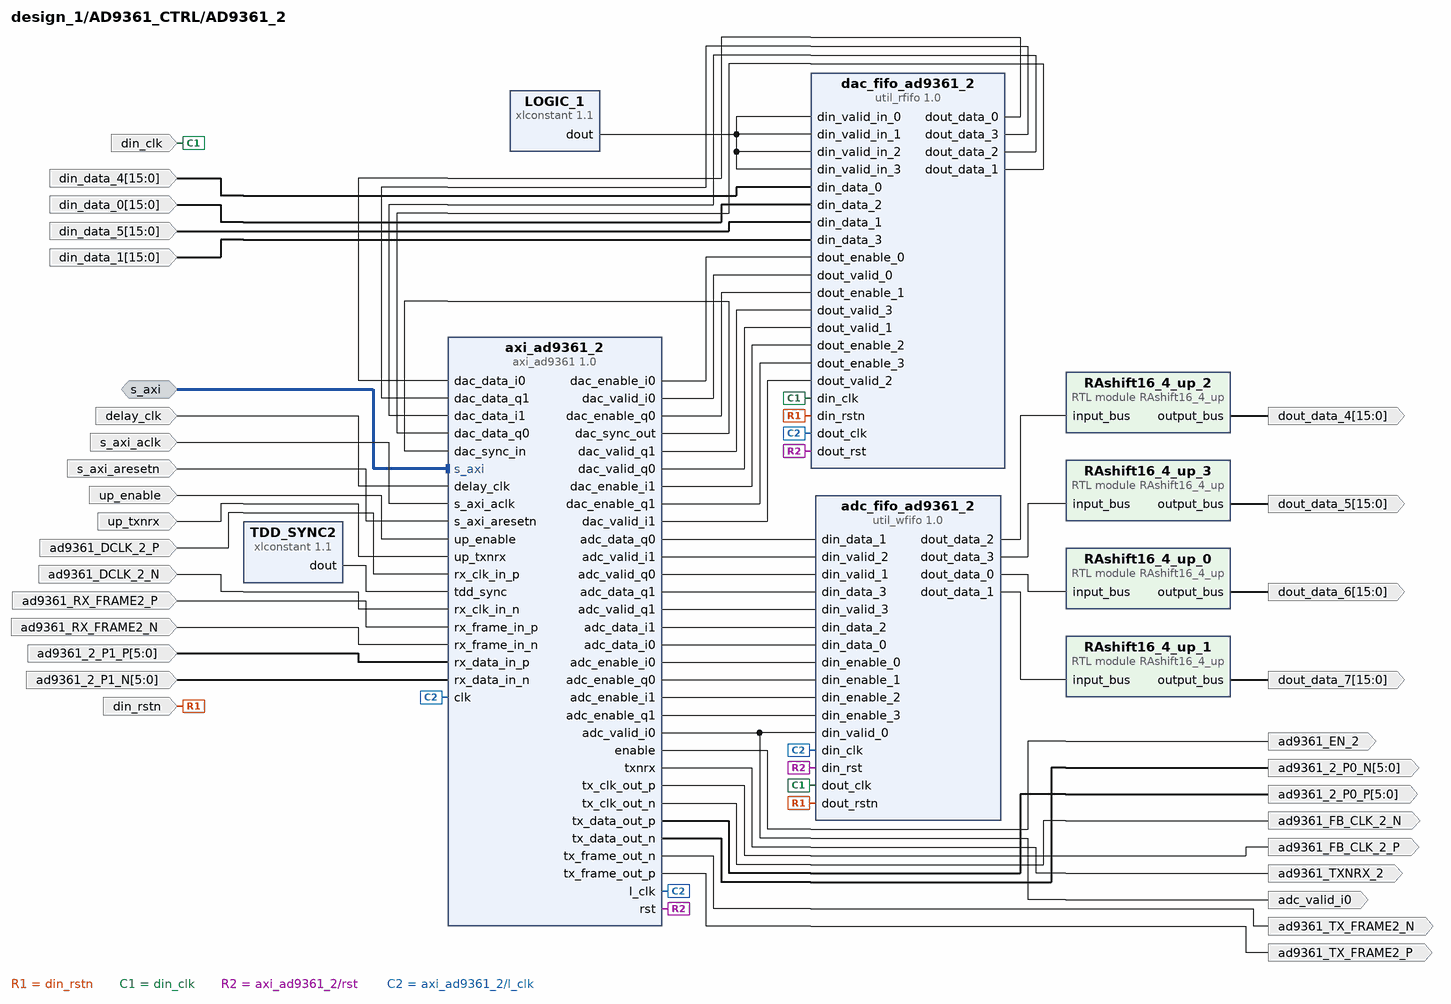
[diagram p6: block diagram inside /AD9361_CTRL/AD9361_2]
create_bd_intf_pin -mode Slave -vlnv xilinx.com:interface:aximm_rtl:1.0 s_axi
create_bd_pin -dir I -type rst din_rstn
create_bd_pin -dir I -type clk din_clk
create_bd_pin -dir I -type clk delay_clk
create_bd_pin -dir I -type clk s_axi_aclk
create_bd_pin -dir I -type rst s_axi_aresetn
create_bd_pin -dir O ad9361_TXNRX_2
create_bd_pin -dir O ad9361_EN_2
create_bd_pin -dir I up_enable
create_bd_pin -dir I up_txnrx
create_bd_pin -dir I ad9361_DCLK_2_P
create_bd_pin -dir I ad9361_DCLK_2_N
create_bd_pin -dir I ad9361_RX_FRAME2_P
create_bd_pin -dir I ad9361_RX_FRAME2_N
create_bd_pin -dir I -from 5 -to 0 ad9361_2_P1_P
create_bd_pin -dir I -from 5 -to 0 ad9361_2_P1_N
create_bd_pin -dir O ad9361_FB_CLK_2_P
create_bd_pin -dir O ad9361_FB_CLK_2_N
create_bd_pin -dir O ad9361_TX_FRAME2_P
create_bd_pin -dir O ad9361_TX_FRAME2_N
create_bd_pin -dir O -from 5 -to 0 ad9361_2_P0_P
create_bd_pin -dir O -from 5 -to 0 ad9361_2_P0_N
create_bd_pin -dir I -from 15 -to 0 din_data_0
create_bd_pin -dir I -from 15 -to 0 din_data_1
create_bd_pin -dir O -from 15 -to 0 dout_data_4
create_bd_pin -dir O -from 15 -to 0 dout_data_5
create_bd_pin -dir O -from 15 -to 0 dout_data_6
create_bd_pin -dir O -from 15 -to 0 dout_data_7
create_bd_pin -dir I -from 15 -to 0 din_data_4
create_bd_pin -dir I -from 15 -to 0 din_data_5
create_bd_pin -dir O adc_valid_i0

create_bd_cell -type ip -vlnv xilinx.com:ip:xlconstant:1.1 TDD_SYNC2
set_property -dict {CONFIG.CONST_VAL 0} [get_bd_cells TDD_SYNC2]
create_bd_cell -type ip -vlnv xilinx.com:ip:xlconstant:1.1 LOGIC_1
set_property -dict {CONFIG.CONST_VAL 1} [get_bd_cells LOGIC_1]
create_bd_cell -type ip -vlnv analog.com:user:util_wfifo:1.0 adc_fifo_ad9361_2
set_property -dict [list \
  CONFIG.DIN_ADDRESS_WIDTH 4 \
  CONFIG.DIN_DATA_WIDTH 16 \
  CONFIG.DOUT_DATA_WIDTH 16 \
] [get_bd_cells adc_fifo_ad9361_2]
create_bd_cell -type ip -vlnv analog.com:user:util_rfifo:1.0 dac_fifo_ad9361_2
set_property -dict [list \
  CONFIG.DIN_ADDRESS_WIDTH 4 \
  CONFIG.DIN_DATA_WIDTH 16 \
  CONFIG.DOUT_DATA_WIDTH 16 \
] [get_bd_cells dac_fifo_ad9361_2]
create_bd_cell -type module -reference RAshift16_4_up RAshift16_4_up_1
create_bd_cell -type module -reference RAshift16_4_up RAshift16_4_up_2
create_bd_cell -type module -reference RAshift16_4_up RAshift16_4_up_3
create_bd_cell -type module -reference RAshift16_4_up RAshift16_4_up_0
create_bd_cell -type ip -vlnv analog.com:user:axi_ad9361:1.0 axi_ad9361_2
set_property -dict [list \
  CONFIG.ADC_DATAFORMAT_DISABLE 0 \
  CONFIG.ADC_DATAPATH_DISABLE 0 \
  CONFIG.ADC_DCFILTER_DISABLE 1 \
  CONFIG.ADC_INIT_DELAY 0 \
  CONFIG.ADC_IQCORRECTION_DISABLE 1 \
  CONFIG.ADC_USERPORTS_DISABLE 0 \
  CONFIG.CMOS_OR_LVDS_N 0 \
  CONFIG.DAC_DATAPATH_DISABLE 0 \
  CONFIG.DAC_DDS_DISABLE 1 \
  CONFIG.DAC_DDS_TYPE 1 \
  CONFIG.DAC_INIT_DELAY 0 \
  CONFIG.DAC_IQCORRECTION_DISABLE 1 \
  CONFIG.DAC_USERPORTS_DISABLE 0 \
  CONFIG.DEV_PACKAGE 3 \
  CONFIG.FPGA_FAMILY 3 \
  CONFIG.FPGA_TECHNOLOGY 1 \
  CONFIG.ID 0 \
  CONFIG.IO_DELAY_GROUP dev_1_if_delay_group \
  CONFIG.SPEED_GRADE 10 \
  CONFIG.TDD_DISABLE 1 \
] [get_bd_cells axi_ad9361_2]

# ---- hierarchy /AD9361_CTRL/AD9361_3 ----
current_bd_instance /AD9361_CTRL/AD9361_3
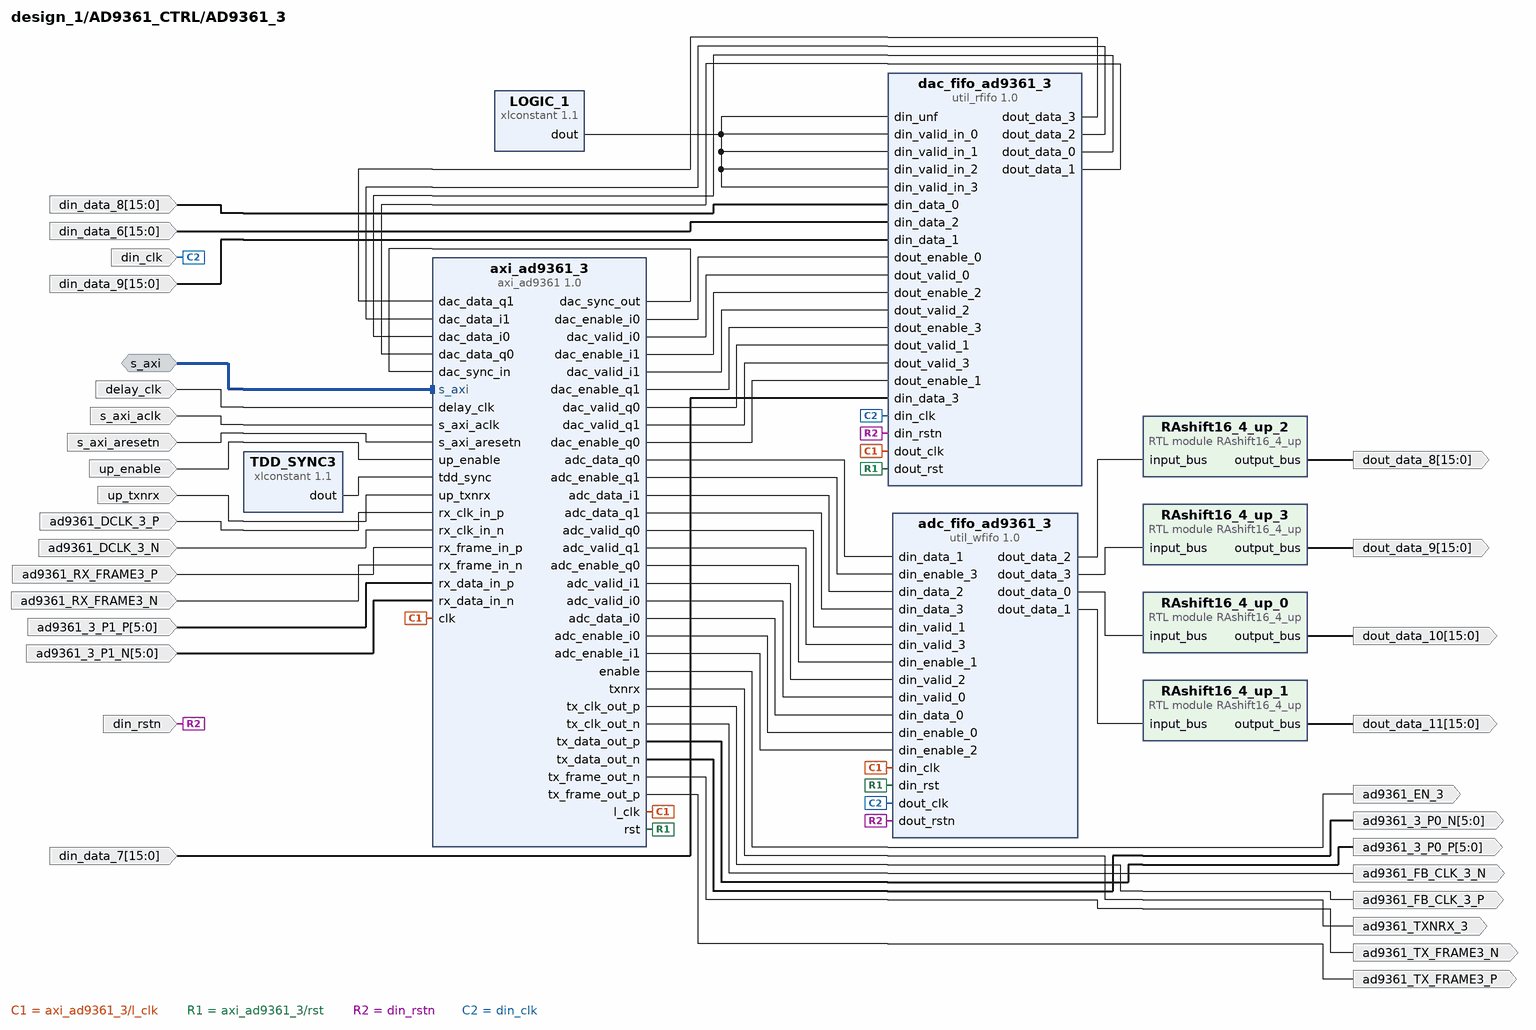
[diagram p7: block diagram inside /AD9361_CTRL/AD9361_3]
create_bd_intf_pin -mode Slave -vlnv xilinx.com:interface:aximm_rtl:1.0 s_axi
create_bd_pin -dir I -type rst din_rstn
create_bd_pin -dir I -type clk din_clk
create_bd_pin -dir I -type clk delay_clk
create_bd_pin -dir I -type clk s_axi_aclk
create_bd_pin -dir I -type rst s_axi_aresetn
create_bd_pin -dir O ad9361_EN_3
create_bd_pin -dir O ad9361_TXNRX_3
create_bd_pin -dir I up_enable
create_bd_pin -dir I up_txnrx
create_bd_pin -dir I ad9361_DCLK_3_P
create_bd_pin -dir I ad9361_DCLK_3_N
create_bd_pin -dir I ad9361_RX_FRAME3_P
create_bd_pin -dir I ad9361_RX_FRAME3_N
create_bd_pin -dir I -from 5 -to 0 ad9361_3_P1_P
create_bd_pin -dir I -from 5 -to 0 ad9361_3_P1_N
create_bd_pin -dir O ad9361_FB_CLK_3_P
create_bd_pin -dir O ad9361_FB_CLK_3_N
create_bd_pin -dir O ad9361_TX_FRAME3_P
create_bd_pin -dir O ad9361_TX_FRAME3_N
create_bd_pin -dir O -from 5 -to 0 ad9361_3_P0_P
create_bd_pin -dir O -from 5 -to 0 ad9361_3_P0_N
create_bd_pin -dir O -from 15 -to 0 dout_data_8
create_bd_pin -dir O -from 15 -to 0 dout_data_9
create_bd_pin -dir O -from 15 -to 0 dout_data_10
create_bd_pin -dir O -from 15 -to 0 dout_data_11
create_bd_pin -dir I -from 15 -to 0 din_data_6
create_bd_pin -dir I -from 15 -to 0 din_data_7
create_bd_pin -dir I -from 15 -to 0 din_data_8
create_bd_pin -dir I -from 15 -to 0 din_data_9

create_bd_cell -type ip -vlnv xilinx.com:ip:xlconstant:1.1 TDD_SYNC3
set_property -dict {CONFIG.CONST_VAL 0} [get_bd_cells TDD_SYNC3]
create_bd_cell -type ip -vlnv xilinx.com:ip:xlconstant:1.1 LOGIC_1
set_property -dict {CONFIG.CONST_VAL 1} [get_bd_cells LOGIC_1]
create_bd_cell -type ip -vlnv analog.com:user:util_wfifo:1.0 adc_fifo_ad9361_3
set_property -dict [list \
  CONFIG.DIN_ADDRESS_WIDTH 4 \
  CONFIG.DIN_DATA_WIDTH 16 \
  CONFIG.DOUT_DATA_WIDTH 16 \
] [get_bd_cells adc_fifo_ad9361_3]
create_bd_cell -type ip -vlnv analog.com:user:util_rfifo:1.0 dac_fifo_ad9361_3
set_property -dict [list \
  CONFIG.DIN_ADDRESS_WIDTH 4 \
  CONFIG.DIN_DATA_WIDTH 16 \
  CONFIG.DOUT_DATA_WIDTH 16 \
] [get_bd_cells dac_fifo_ad9361_3]
create_bd_cell -type module -reference RAshift16_4_up RAshift16_4_up_0
create_bd_cell -type module -reference RAshift16_4_up RAshift16_4_up_1
create_bd_cell -type module -reference RAshift16_4_up RAshift16_4_up_2
create_bd_cell -type module -reference RAshift16_4_up RAshift16_4_up_3
create_bd_cell -type ip -vlnv analog.com:user:axi_ad9361:1.0 axi_ad9361_3
set_property -dict [list \
  CONFIG.ADC_DATAFORMAT_DISABLE 0 \
  CONFIG.ADC_DATAPATH_DISABLE 0 \
  CONFIG.ADC_DCFILTER_DISABLE 1 \
  CONFIG.ADC_INIT_DELAY 0 \
  CONFIG.ADC_IQCORRECTION_DISABLE 1 \
  CONFIG.ADC_USERPORTS_DISABLE 0 \
  CONFIG.CMOS_OR_LVDS_N 0 \
  CONFIG.DAC_DATAPATH_DISABLE 0 \
  CONFIG.DAC_DDS_DISABLE 1 \
  CONFIG.DAC_DDS_TYPE 1 \
  CONFIG.DAC_INIT_DELAY 0 \
  CONFIG.DAC_IQCORRECTION_DISABLE 1 \
  CONFIG.DAC_USERPORTS_DISABLE 0 \
  CONFIG.DEV_PACKAGE 3 \
  CONFIG.FPGA_FAMILY 3 \
  CONFIG.FPGA_TECHNOLOGY 1 \
  CONFIG.ID 0 \
  CONFIG.IO_DELAY_GROUP dev_3_if_delay_group \
  CONFIG.SPEED_GRADE 10 \
  CONFIG.TDD_DISABLE 1 \
] [get_bd_cells axi_ad9361_3]

# ---- hierarchy /AD9361_CTRL/ad9361_clk ----
current_bd_instance /AD9361_CTRL/ad9361_clk
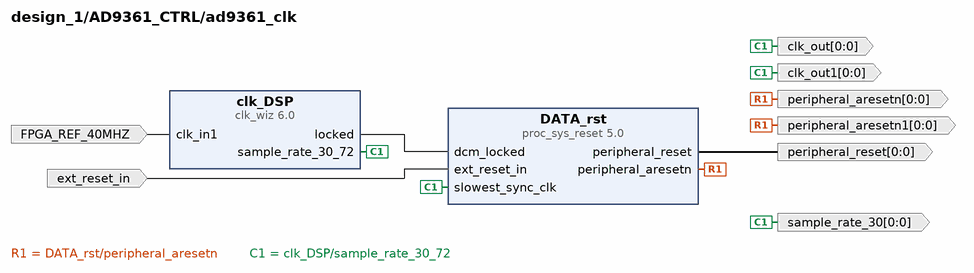
[diagram p8: block diagram inside /AD9361_CTRL/ad9361_clk]
create_bd_pin -dir O -from 0 -to 0 -type clk clk_out
create_bd_pin -dir O -from 0 -to 0 -type rst peripheral_aresetn
create_bd_pin -dir I -type clk FPGA_REF_40MHZ
create_bd_pin -dir O -from 0 -to 0 -type clk sample_rate_30
create_bd_pin -dir O -from 0 -to 0 -type clk clk_out1
create_bd_pin -dir O -from 0 -to 0 -type rst peripheral_aresetn1
create_bd_pin -dir I -type rst ext_reset_in
create_bd_pin -dir O -from 0 -to 0 -type rst peripheral_reset

create_bd_cell -type ip -vlnv xilinx.com:ip:clk_wiz:6.0 clk_DSP
set_property -dict [list \
  CONFIG.CLKIN1_JITTER_PS 250.0 \
  CONFIG.CLKOUT1_JITTER 271.412 \
  CONFIG.CLKOUT1_PHASE_ERROR 196.976 \
  CONFIG.CLKOUT1_REQUESTED_OUT_FREQ 30.72 \
  CONFIG.CLKOUT2_JITTER 158.000 \
  CONFIG.CLKOUT2_PHASE_ERROR 196.976 \
  CONFIG.CLKOUT2_REQUESTED_OUT_FREQ 100.000 \
  CONFIG.CLKOUT2_USED false \
  CONFIG.CLKOUT3_JITTER 158.000 \
  CONFIG.CLKOUT3_PHASE_ERROR 196.976 \
  CONFIG.CLKOUT3_REQUESTED_OUT_FREQ 100.000 \
  CONFIG.CLKOUT3_USED false \
  CONFIG.CLKOUT4_JITTER 247.096 \
  CONFIG.CLKOUT4_PHASE_ERROR 196.976 \
  CONFIG.CLKOUT4_REQUESTED_OUT_FREQ 100.000 \
  CONFIG.CLKOUT4_USED false \
  CONFIG.CLK_OUT1_PORT sample_rate_30_72 \
  CONFIG.CLK_OUT2_PORT clk_out2 \
  CONFIG.CLK_OUT3_PORT clk_out3 \
  CONFIG.CLK_OUT4_PORT clk_out4 \
  CONFIG.JITTER_SEL No_Jitter \
  CONFIG.MMCM_BANDWIDTH OPTIMIZED \
  CONFIG.MMCM_CLKFBOUT_MULT_F 24.000 \
  CONFIG.MMCM_CLKIN1_PERIOD 25.000 \
  CONFIG.MMCM_CLKIN2_PERIOD 10.0 \
  CONFIG.MMCM_CLKOUT0_DIVIDE_F 31.250 \
  CONFIG.MMCM_CLKOUT1_DIVIDE 1 \
  CONFIG.MMCM_CLKOUT2_DIVIDE 1 \
  CONFIG.MMCM_CLKOUT3_DIVIDE 1 \
  CONFIG.MMCM_DIVCLK_DIVIDE 1 \
  CONFIG.NUM_OUT_CLKS 1 \
  CONFIG.PRIM_IN_FREQ 40 \
  CONFIG.PRIM_SOURCE No_buffer \
  CONFIG.USE_LOCKED true \
  CONFIG.USE_RESET false \
] [get_bd_cells clk_DSP]
create_bd_cell -type ip -vlnv xilinx.com:ip:proc_sys_reset:5.0 DATA_rst
set_property -dict {CONFIG.C_AUX_RESET_HIGH 0 CONFIG.C_AUX_RST_WIDTH 16 CONFIG.C_EXT_RST_WIDTH 16} [get_bd_cells DATA_rst]

# ---- hierarchy /SPI_MOD ----
current_bd_instance /SPI_MOD
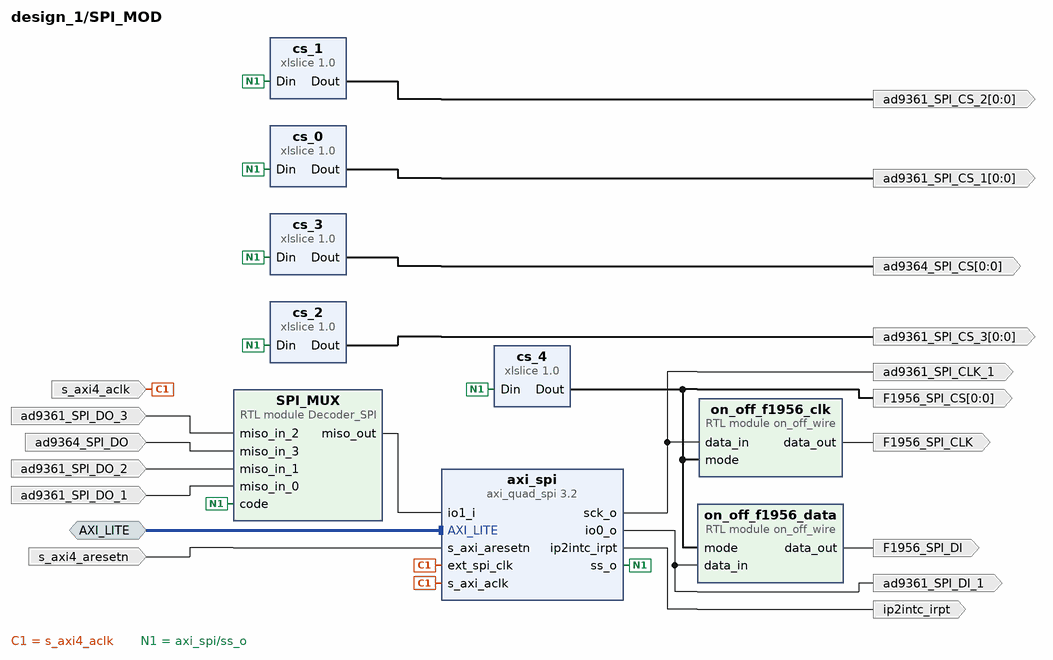
[diagram p9: block diagram inside /SPI_MOD]
create_bd_intf_pin -mode Slave -vlnv xilinx.com:interface:aximm_rtl:1.0 AXI_LITE
create_bd_pin -dir I ad9364_SPI_DO
create_bd_pin -dir O -from 0 -to 0 ad9364_SPI_CS
create_bd_pin -dir I -type rst s_axi4_aresetn
create_bd_pin -dir O ad9361_SPI_CLK_1
create_bd_pin -dir O -from 0 -to 0 ad9361_SPI_CS_3
create_bd_pin -dir O -type intr ip2intc_irpt
create_bd_pin -dir I ad9361_SPI_DO_1
create_bd_pin -dir O -from 0 -to 0 ad9361_SPI_CS_1
create_bd_pin -dir I ad9361_SPI_DO_2
create_bd_pin -dir O -from 0 -to 0 ad9361_SPI_CS_2
create_bd_pin -dir O ad9361_SPI_DI_1
create_bd_pin -dir I ad9361_SPI_DO_3
create_bd_pin -dir I -type clk s_axi4_aclk
create_bd_pin -dir O -from 0 -to 0 F1956_SPI_CS
create_bd_pin -dir O F1956_SPI_DI
create_bd_pin -dir O F1956_SPI_CLK

create_bd_cell -type ip -vlnv xilinx.com:ip:axi_quad_spi:3.2 axi_spi
set_property -dict [list \
  CONFIG.C_FAMILY artix7 \
  CONFIG.C_FIFO_DEPTH 256 \
  CONFIG.C_NUM_SS_BITS 5 \
  CONFIG.C_SCK_RATIO 16 \
  CONFIG.C_SUB_FAMILY artix7 \
  CONFIG.C_S_AXI4_ID_WIDTH 0 \
  CONFIG.C_TYPE_OF_AXI4_INTERFACE 0 \
  CONFIG.C_USE_STARTUP 0 \
  CONFIG.C_XIP_MODE 0 \
  CONFIG.Multiples16 10 \
] [get_bd_cells axi_spi]
create_bd_cell -type ip -vlnv xilinx.com:ip:xlslice:1.0 cs_0
set_property -dict {CONFIG.DIN_FROM 0 CONFIG.DIN_TO 0 CONFIG.DIN_WIDTH 5} [get_bd_cells cs_0]
create_bd_cell -type ip -vlnv xilinx.com:ip:xlslice:1.0 cs_1
set_property -dict {CONFIG.DIN_FROM 1 CONFIG.DIN_TO 1 CONFIG.DIN_WIDTH 5 CONFIG.DOUT_WIDTH 1} [get_bd_cells cs_1]
create_bd_cell -type ip -vlnv xilinx.com:ip:xlslice:1.0 cs_2
set_property -dict {CONFIG.DIN_FROM 2 CONFIG.DIN_TO 2 CONFIG.DIN_WIDTH 5 CONFIG.DOUT_WIDTH 1} [get_bd_cells cs_2]
create_bd_cell -type ip -vlnv xilinx.com:ip:xlslice:1.0 cs_3
set_property -dict {CONFIG.DIN_FROM 3 CONFIG.DIN_TO 3 CONFIG.DIN_WIDTH 5 CONFIG.DOUT_WIDTH 1} [get_bd_cells cs_3]
create_bd_cell -type ip -vlnv xilinx.com:ip:xlslice:1.0 cs_4
set_property -dict {CONFIG.DIN_FROM 4 CONFIG.DIN_TO 4 CONFIG.DIN_WIDTH 5 CONFIG.DOUT_WIDTH 1} [get_bd_cells cs_4]
create_bd_cell -type module -reference on_off_wire on_off_f1956_data
create_bd_cell -type module -reference on_off_wire on_off_f1956_clk
create_bd_cell -type module -reference Decoder_SPI SPI_MUX

# ---- connections ----

current_bd_instance /AXI_Peripheral
connect_bd_intf_net [get_bd_intf_pins M06_AXI] [get_bd_intf_pins AXI_C2C_axi_periph/M11_AXI]
connect_bd_intf_net [get_bd_intf_pins M03_AXI] [get_bd_intf_pins AXI_C2C_axi_periph/M03_AXI]
connect_bd_intf_net [get_bd_intf_pins M07_AXI] [get_bd_intf_pins AXI_C2C_axi_periph/M07_AXI]
connect_bd_intf_net [get_bd_intf_pins AXI_C2C_axi_periph/M04_AXI] [get_bd_intf_pins AXI_DMA/s_axi]
connect_bd_intf_net [get_bd_intf_pins M09_AXI] [get_bd_intf_pins AXI_C2C_axi_periph/M09_AXI]
connect_bd_intf_net [get_bd_intf_pins M14_AXI] [get_bd_intf_pins AXI_C2C_axi_periph/M14_AXI]
connect_bd_intf_net [get_bd_intf_pins AXI_C2C_axi_periph/S00_AXI] [get_bd_intf_pins AXI_C2C/m_axi_lite]
connect_bd_intf_net [get_bd_intf_pins M05_AXI] [get_bd_intf_pins AXI_C2C_axi_periph/M05_AXI]
connect_bd_intf_net [get_bd_intf_pins M08_AXI] [get_bd_intf_pins AXI_C2C_axi_periph/M08_AXI]
connect_bd_intf_net [get_bd_intf_pins M02_AXI] [get_bd_intf_pins AXI_C2C_axi_periph/M00_AXI]
connect_bd_intf_net [get_bd_intf_pins M00_AXI] [get_bd_intf_pins AXI_C2C_axi_periph/M01_AXI]
connect_bd_intf_net [get_bd_intf_pins M04_AXI] [get_bd_intf_pins AXI_C2C_axi_periph/M06_AXI]
connect_bd_intf_net [get_bd_intf_pins AXI_DMA/m_dest_axi] [get_bd_intf_pins AXI_C2C/s_axi]
connect_bd_intf_net [get_bd_intf_pins M01_AXI] [get_bd_intf_pins AXI_C2C_axi_periph/M02_AXI]
connect_bd_intf_net [get_bd_intf_pins M12_AXI] [get_bd_intf_pins AXI_C2C_axi_periph/M12_AXI]
connect_bd_intf_net [get_bd_intf_pins M10_AXI] [get_bd_intf_pins AXI_C2C_axi_periph/M10_AXI]
connect_bd_net [get_bd_pins GND/dout] [get_bd_pins Concat/In2] [get_bd_pins Concat/In3]
connect_bd_net -net In0_1 [get_bd_pins In0] [get_bd_pins Concat/In0]
connect_bd_net -net M12_ARESETN_1 [get_bd_pins S00_ARESETN] \
  [get_bd_pins AXI_C2C_axi_periph/S00_ARESETN] [get_bd_pins AXI_C2C_axi_periph/M00_ARESETN] \
  [get_bd_pins AXI_C2C_axi_periph/ARESETN] [get_bd_pins AXI_C2C_axi_periph/M01_ARESETN] \
  [get_bd_pins AXI_C2C_axi_periph/M02_ARESETN] [get_bd_pins AXI_C2C_axi_periph/M03_ARESETN] \
  [get_bd_pins AXI_C2C_axi_periph/M04_ARESETN] [get_bd_pins AXI_C2C_axi_periph/M05_ARESETN] \
  [get_bd_pins AXI_C2C_axi_periph/M06_ARESETN] [get_bd_pins AXI_C2C_axi_periph/M07_ARESETN] \
  [get_bd_pins AXI_C2C_axi_periph/M08_ARESETN] [get_bd_pins AXI_C2C_axi_periph/M09_ARESETN] \
  [get_bd_pins AXI_C2C_axi_periph/M10_ARESETN] [get_bd_pins AXI_C2C_axi_periph/M11_ARESETN] \
  [get_bd_pins AXI_C2C_axi_periph/M12_ARESETN] [get_bd_pins AXI_C2C_axi_periph/M13_ARESETN] \
  [get_bd_pins AXI_C2C_axi_periph/M14_ARESETN] [get_bd_pins AXI_C2C_axi_periph/M15_ARESETN] \
  [get_bd_pins AXI_DMA/s_axi_aresetn] [get_bd_pins AXI_DMA/m_dest_axi_aresetn] [get_bd_pins AXI_C2C/s_aresetn]
connect_bd_net [get_bd_pins m_aclk] \
  [get_bd_pins AXI_C2C_axi_periph/ACLK] [get_bd_pins AXI_C2C_axi_periph/S00_ACLK] [get_bd_pins AXI_C2C_axi_periph/M00_ACLK] \
  [get_bd_pins AXI_C2C_axi_periph/M01_ACLK] [get_bd_pins AXI_C2C_axi_periph/M02_ACLK] \
  [get_bd_pins AXI_C2C_axi_periph/M03_ACLK] [get_bd_pins AXI_C2C_axi_periph/M04_ACLK] \
  [get_bd_pins AXI_C2C_axi_periph/M05_ACLK] [get_bd_pins AXI_C2C_axi_periph/M06_ACLK] \
  [get_bd_pins AXI_C2C_axi_periph/M07_ACLK] [get_bd_pins AXI_C2C_axi_periph/M08_ACLK] \
  [get_bd_pins AXI_C2C_axi_periph/M09_ACLK] [get_bd_pins AXI_C2C_axi_periph/M10_ACLK] \
  [get_bd_pins AXI_C2C_axi_periph/M11_ACLK] [get_bd_pins AXI_C2C_axi_periph/M12_ACLK] \
  [get_bd_pins AXI_C2C_axi_periph/M13_ACLK] [get_bd_pins AXI_C2C_axi_periph/M14_ACLK] \
  [get_bd_pins AXI_C2C_axi_periph/M15_ACLK] [get_bd_pins AXI_DMA/s_axi_aclk] [get_bd_pins AXI_DMA/m_dest_axi_aclk] \
  [get_bd_pins AXI_C2C/m_axi_lite_aclk] [get_bd_pins AXI_C2C/axi_c2c_phy_clk] [get_bd_pins AXI_C2C/s_aclk]
connect_bd_net -net axi_dmac_0_irq [get_bd_pins AXI_DMA/irq] [get_bd_pins Concat/In1]
connect_bd_net [get_bd_pins idelay_ref_clk] [get_bd_pins AXI_C2C/idelay_ref_clk]
connect_bd_net [get_bd_pins AXI_TX_CLK_IN] [get_bd_pins AXI_C2C/axi_c2c_selio_rx_clk_in]
connect_bd_net [get_bd_pins AXI_TX_DATA_IN] [get_bd_pins AXI_C2C/axi_c2c_selio_rx_data_in]
connect_bd_net [get_bd_pins AXI_C2C/axi_c2c_selio_tx_data_out] [get_bd_pins AXI_RX_DATA_OUT]
connect_bd_net [get_bd_pins AXI_C2C/axi_c2c_selio_tx_clk_out] [get_bd_pins AXI_RX_CLK_OUT]
connect_bd_net [get_bd_pins AXI_DMA/fifo_wr_xfer_req] [get_bd_pins fifo_wr_xfer_req]
connect_bd_net [get_bd_pins fifo_wr_clk] [get_bd_pins AXI_DMA/fifo_wr_clk]
connect_bd_net [get_bd_pins VCC/dout] [get_bd_pins AXI_DMA/fifo_wr_en] [get_bd_pins AXI_DMA/fifo_wr_sync]
connect_bd_net -net fifo_wr_data_0_1 [get_bd_pins fifo_wr_data_0] [get_bd_pins xlconcat_1/In0]
connect_bd_net -net fifo_wr_data_1_1 [get_bd_pins fifo_wr_data_1] [get_bd_pins xlconcat_1/In1]
connect_bd_net [get_bd_pins xlconcat_1/dout] [get_bd_pins AXI_DMA/fifo_wr_din]
connect_bd_net [get_bd_pins Concat/dout] [get_bd_pins AXI_C2C/axi_c2c_m2s_intr_in]

current_bd_instance /CLK_AXI
connect_bd_net -net clk_wiz_0_axi_periph_clk [get_bd_pins CLK_COMMON/axi_periph_clk] \
  [get_bd_pins axi_periph_clk] [get_bd_pins AXI_reset/slowest_sync_clk] [get_bd_pins FPGA_reset/clk]
connect_bd_net -net clk_wiz_0_delay_clk [get_bd_pins CLK_COMMON/delay_clk] [get_bd_pins delay_clk]
connect_bd_net -net clk_wiz_0_locked [get_bd_pins CLK_COMMON/locked] [get_bd_pins AXI_reset/dcm_locked] [get_bd_pins FPGA_reset/locked]
connect_bd_net -net proc_sys_reset_0_peripheral_aresetn [get_bd_pins AXI_reset/peripheral_aresetn] [get_bd_pins peripheral_aresetn]
connect_bd_net -net FPGA_reset_0_reset_n [get_bd_pins FPGA_reset/reset_n] [get_bd_pins AXI_reset/ext_reset_in] [get_bd_pins reset_n]
connect_bd_net [get_bd_pins ibuf_0/out_ref] [get_bd_pins out_ref] [get_bd_pins CLK_COMMON/clk_in1]
connect_bd_net [get_bd_pins FPGA_REF_40MHZ] [get_bd_pins ibuf_0/in_ref]

current_bd_instance /AD9364
connect_bd_intf_net [get_bd_intf_pins s_axi] [get_bd_intf_pins axi_ad9364/s_axi]
connect_bd_net -net din_rst_1 [get_bd_pins axi_ad9364/rst] [get_bd_pins adc_fifo_ad9364_0/din_rst] [get_bd_pins dac_fifo_ad9364_0/dout_rst]
connect_bd_net -net dout_rstn_1 [get_bd_pins divclk_64_rst1/peripheral_aresetn] \
  [get_bd_pins adc_fifo_ad9364_0/dout_rstn] [get_bd_pins dac_fifo_ad9364_0/din_rstn]
connect_bd_net [get_bd_pins dout_clk] \
  [get_bd_pins adc_fifo_ad9364_0/dout_clk] [get_bd_pins dac_fifo_ad9364_0/din_clk] \
  [get_bd_pins divclk_64_rst1/slowest_sync_clk]
connect_bd_net [get_bd_pins delay_clk] [get_bd_pins axi_ad9364/delay_clk]
connect_bd_net [get_bd_pins s_axi_aclk] [get_bd_pins axi_ad9364/s_axi_aclk]
connect_bd_net [get_bd_pins s_axi_aresetn] [get_bd_pins axi_ad9364/s_axi_aresetn]
connect_bd_net [get_bd_pins axi_ad9364/l_clk] \
  [get_bd_pins adc_fifo_ad9364_0/din_clk] [get_bd_pins dac_fifo_ad9364_0/dout_clk] [get_bd_pins axi_ad9364/clk]
connect_bd_net [get_bd_pins axi_ad9364/adc_enable_q0] [get_bd_pins adc_fifo_ad9364_0/din_enable_1]
connect_bd_net [get_bd_pins axi_ad9364/adc_valid_q0] [get_bd_pins adc_fifo_ad9364_0/din_valid_1]
connect_bd_net [get_bd_pins axi_ad9364/adc_enable_i0] [get_bd_pins adc_fifo_ad9364_0/din_enable_0]
connect_bd_net [get_bd_pins axi_ad9364/adc_data_i0] [get_bd_pins adc_fifo_ad9364_0/din_data_0]
connect_bd_net [get_bd_pins axi_ad9364/adc_data_q0] [get_bd_pins adc_fifo_ad9364_0/din_data_1]
connect_bd_net [get_bd_pins axi_ad9364/adc_valid_i0] [get_bd_pins adc_fifo_ad9364_0/din_valid_0]
connect_bd_net [get_bd_pins axi_ad9364/enable] [get_bd_pins ad9364_EN]
connect_bd_net [get_bd_pins axi_ad9364/txnrx] [get_bd_pins ad9364_TXNRX]
connect_bd_net [get_bd_pins axi_ad9364/dac_sync_out] [get_bd_pins axi_ad9364/dac_sync_in]
connect_bd_net [get_bd_pins TDD_SYNC4/dout] [get_bd_pins axi_ad9364/tdd_sync]
connect_bd_net [get_bd_pins up_enable] [get_bd_pins axi_ad9364/up_enable]
connect_bd_net [get_bd_pins up_txnrx] [get_bd_pins axi_ad9364/up_txnrx]
connect_bd_net [get_bd_pins ad9364_DCLK_P] [get_bd_pins axi_ad9364/rx_clk_in_p]
connect_bd_net [get_bd_pins ad9364_DCLK_N] [get_bd_pins axi_ad9364/rx_clk_in_n]
connect_bd_net [get_bd_pins ad9364_TX_FRAME_P] [get_bd_pins axi_ad9364/rx_frame_in_p]
connect_bd_net [get_bd_pins ad9364_TX_FRAME_N] [get_bd_pins axi_ad9364/rx_frame_in_n]
connect_bd_net [get_bd_pins ad9364_P1_P] [get_bd_pins axi_ad9364/rx_data_in_p]
connect_bd_net [get_bd_pins ad9364_P1_N] [get_bd_pins axi_ad9364/rx_data_in_n]
connect_bd_net [get_bd_pins axi_ad9364/tx_clk_out_p] [get_bd_pins ad9361_FB_CLK_P]
connect_bd_net [get_bd_pins axi_ad9364/tx_clk_out_n] [get_bd_pins ad9364_FB_CLK_N]
connect_bd_net [get_bd_pins axi_ad9364/tx_frame_out_p] [get_bd_pins ad9364_TX_FRAME_P1]
connect_bd_net [get_bd_pins axi_ad9364/tx_frame_out_n] [get_bd_pins ad9364_TX_FRAME_N1]
connect_bd_net [get_bd_pins axi_ad9364/tx_data_out_p] [get_bd_pins ad9364_P0_P]
connect_bd_net [get_bd_pins axi_ad9364/tx_data_out_n] [get_bd_pins ad9364_P0_N]
connect_bd_net [get_bd_pins LOGIC_1/dout] [get_bd_pins dac_fifo_ad9364_0/din_valid_in_0] [get_bd_pins dac_fifo_ad9364_0/din_valid_in_1]
connect_bd_net [get_bd_pins dac_fifo_ad9364_0/dout_data_1] \
  [get_bd_pins axi_ad9364/dac_data_q0] [get_bd_pins axi_ad9364/dac_data_q1] [get_bd_pins axi_ad9364/dac_dunf]
connect_bd_net [get_bd_pins axi_ad9364/dac_valid_q0] [get_bd_pins dac_fifo_ad9364_0/dout_valid_1]
connect_bd_net [get_bd_pins axi_ad9364/dac_enable_q0] [get_bd_pins dac_fifo_ad9364_0/dout_enable_1]
connect_bd_net [get_bd_pins axi_ad9364/dac_valid_i0] [get_bd_pins dac_fifo_ad9364_0/dout_valid_0]
connect_bd_net [get_bd_pins dac_fifo_ad9364_0/dout_data_0] [get_bd_pins axi_ad9364/dac_data_i0] [get_bd_pins axi_ad9364/dac_data_i1]
connect_bd_net [get_bd_pins axi_ad9364/dac_enable_i0] [get_bd_pins dac_fifo_ad9364_0/dout_enable_0]
connect_bd_net [get_bd_pins zero_sample/dout] [get_bd_pins dac_fifo_ad9364_0/din_data_0] [get_bd_pins dac_fifo_ad9364_0/din_data_1]
connect_bd_net [get_bd_pins ext_reset_in] [get_bd_pins divclk_64_rst1/ext_reset_in]
